# Altium project RespiraWorks Ventilator.PrjPcb (part 1 of 4)
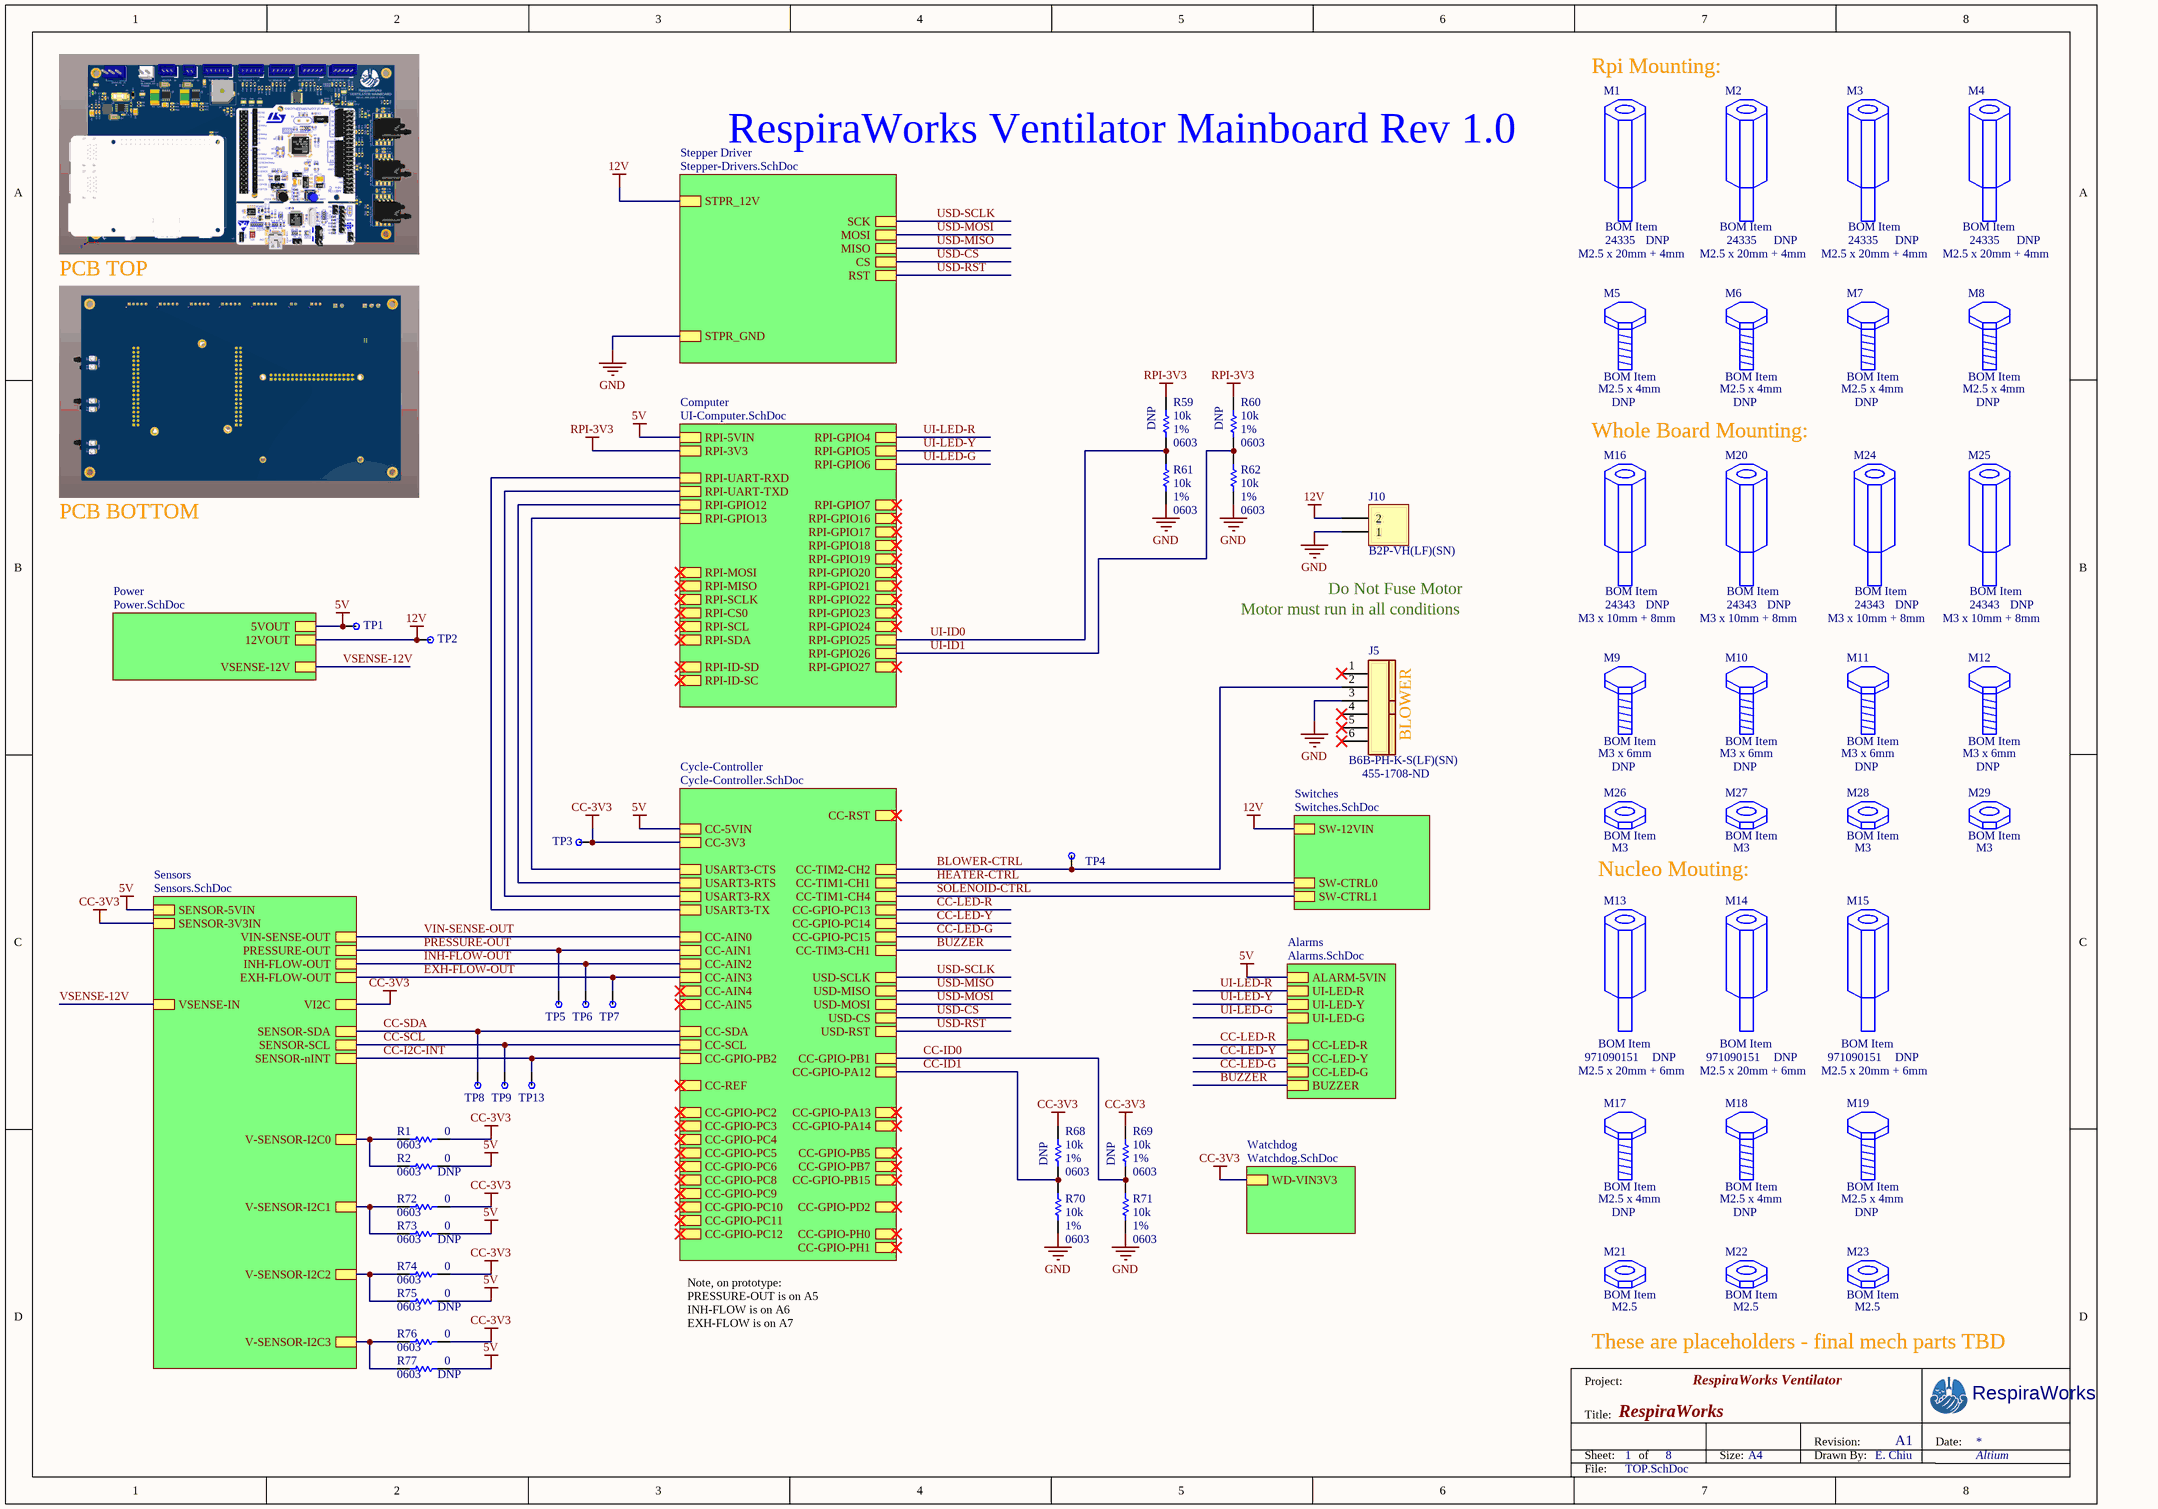
[diagram p0: TOP.SchDoc]
12 sheets, 255 parts. Net scope: hierarchical (ports join the sheet entries above them; power ports are global).
Board file: RespiraWorks Ventilator Rev 1.PcbDoc
Sheets:
  TOP.SchDoc
    Cycle-Controller = Cycle-Controller.SchDoc
    Computer = UI-Computer.SchDoc
    Sensors = Sensors.SchDoc
    Switches = Switches.SchDoc
    Watchdog = Watchdog.SchDoc
    Alarms = Alarms.SchDoc
    Power = Power.SchDoc
    Stepper Driver = Stepper-Drivers.SchDoc
      driver-1 = Stepper-Driver-1.SchDoc
      driver-2 = Stepper-Driver-2.SchDoc
      driver-3 = Stepper-Driver-3.SchDoc

## Sheet TOP.SchDoc: RespiraWorks
size A3; CompanyName: RespiraWorks; DrawnBy: E. Chiu; Organization: Altium; DocumentNumber: 1; Revision: A1; SheetNumber: 1; SheetTotal: 8; PageSetup: Record=PageOptions|CenterHorizontal=True|CenterVertical=True|PrintScale=0.67|XCorrection=1.00|YCorrection=1.00|PrintKind=0|BorderSize=5000000|LeftOffset=0|BottomOffset=0|Orientation=2|PaperLength=1000|PaperWidth=1000|Scale=100|PaperSource=276|PrintQuality=-3|MediaType=1|DitherType=10|PrintScaleMode=1|PaperKind=11"x17" 279.4x431.8mm|PaperIndex=3; ProjectName: FALCON 3S

### Parts
J5  B6B-PH-K-S(LF)(SN)  Supplier Part Number 1: 455-1708-ND  [JST_B6B-XH-AM]
J10  B2P-VH(LF)(SN)  [B2P-VH(LF)(SN)]
M1  BOM Item  value M2.5 x 20mm + 4mm  Manufacturer P/N: 24335  Do Not Populate: DNP  (mechanical)
M2  BOM Item  value M2.5 x 20mm + 4mm  Manufacturer P/N: 24335  Do Not Populate: DNP  (mechanical)
M3  BOM Item  value M2.5 x 20mm + 4mm  Manufacturer P/N: 24335  Do Not Populate: DNP  (mechanical)
M4  BOM Item  value M2.5 x 20mm + 4mm  Manufacturer P/N: 24335  Do Not Populate: DNP  (mechanical)
M5  BOM Item  value M2.5 x 4mm  Do Not Populate: DNP  (mechanical)
M6  BOM Item  value M2.5 x 4mm  Do Not Populate: DNP  (mechanical)
M7  BOM Item  value M2.5 x 4mm  Do Not Populate: DNP  (mechanical)
M8  BOM Item  value M2.5 x 4mm  Do Not Populate: DNP  (mechanical)
M9  BOM Item  value M3 x 6mm  Do Not Populate: DNP  (mechanical)
M10  BOM Item  value M3 x 6mm  Do Not Populate: DNP  (mechanical)
M11  BOM Item  value M3 x 6mm  Do Not Populate: DNP  (mechanical)
M12  BOM Item  value M3 x 6mm  Do Not Populate: DNP  (mechanical)
M13  BOM Item  value M2.5 x 20mm + 6mm  Manufacturer P/N: 971090151  Do Not Populate: DNP  (mechanical)
M14  BOM Item  value M2.5 x 20mm + 6mm  Manufacturer P/N: 971090151  Do Not Populate: DNP  (mechanical)
M15  BOM Item  value M2.5 x 20mm + 6mm  Manufacturer P/N: 971090151  Do Not Populate: DNP  (mechanical)
M16  BOM Item  value M3 x 10mm + 8mm  Manufacturer P/N: 24343  Do Not Populate: DNP  (mechanical)
M17  BOM Item  value M2.5 x 4mm  Do Not Populate: DNP  (mechanical)
M18  BOM Item  value M2.5 x 4mm  Do Not Populate: DNP  (mechanical)
M19  BOM Item  value M2.5 x 4mm  Do Not Populate: DNP  (mechanical)
M20  BOM Item  value M3 x 10mm + 8mm  Manufacturer P/N: 24343  Do Not Populate: DNP  (mechanical)
M21  BOM Item  value M2.5  (mechanical)
M22  BOM Item  value M2.5  (mechanical)
M23  BOM Item  value M2.5  (mechanical)
M24  BOM Item  value M3 x 10mm + 8mm  Manufacturer P/N: 24343  Do Not Populate: DNP  (mechanical)
M25  BOM Item  value M3 x 10mm + 8mm  Manufacturer P/N: 24343  Do Not Populate: DNP  (mechanical)
M26  BOM Item  value M3  (mechanical)
M27  BOM Item  value M3  (mechanical)
M28  BOM Item  value M3  (mechanical)
M29  BOM Item  value M3  (mechanical)
R1  value 0  PCB Package: 0603  [RES0603]  (hidden comment: RES 0603)
R2  value 0  PCB Package: 0603  Do Not Populate: DNP  [RES0603]  (hidden comment: RES 0603)
R59  value 10k  PCB Package: 0603  Tolerance: 1%  Do Not Populate: DNP  [RES0603]  (hidden comment: RES 0603)
R60  value 10k  PCB Package: 0603  Tolerance: 1%  Do Not Populate: DNP  [RES0603]  (hidden comment: RES 0603)
R61  value 10k  PCB Package: 0603  Tolerance: 1%  [RES0603]  (hidden comment: RES 0603)
R62  value 10k  PCB Package: 0603  Tolerance: 1%  [RES0603]  (hidden comment: RES 0603)
R68  value 10k  PCB Package: 0603  Tolerance: 1%  Do Not Populate: DNP  [RES0603]  (hidden comment: RES 0603)
R69  value 10k  PCB Package: 0603  Tolerance: 1%  Do Not Populate: DNP  [RES0603]  (hidden comment: RES 0603)
R70  value 10k  PCB Package: 0603  Tolerance: 1%  [RES0603]  (hidden comment: RES 0603)
R71  value 10k  PCB Package: 0603  Tolerance: 1%  [RES0603]  (hidden comment: RES 0603)
R72  value 0  PCB Package: 0603  [RES0603]  (hidden comment: RES 0603)
R73  value 0  PCB Package: 0603  Do Not Populate: DNP  [RES0603]  (hidden comment: RES 0603)
R74  value 0  PCB Package: 0603  [RES0603]  (hidden comment: RES 0603)
R75  value 0  PCB Package: 0603  Do Not Populate: DNP  [RES0603]  (hidden comment: RES 0603)
R76  value 0  PCB Package: 0603  [RES0603]  (hidden comment: RES 0603)
R77  value 0  PCB Package: 0603  Do Not Populate: DNP  [RES0603]  (hidden comment: RES 0603)
TP1  TP-SMT  [TP-5015]  (value not drawn)
TP2  TP-SMT  [TP-5015]  (value not drawn)
TP3  TP-SMT  [TP-5015]  (value not drawn)
TP4  TP-SMT  [TP-5015]  (value not drawn)
TP5  TP-SMT  [TP-5015]  (value not drawn)
TP6  TP-SMT  [TP-5015]  (value not drawn)
TP7  TP-SMT  [TP-5015]  (value not drawn)
TP8  TP-SMT  [TP-5015]  (value not drawn)
TP9  TP-SMT  [TP-5015]  (value not drawn)
TP13  TP-SMT  [TP-5015]  (value not drawn)

### Sub-sheets
Alarms = Alarms.SchDoc: BUZZER, CC-LED-R, UI-LED-Y, CC-LED-G, UI-LED-G, UI-LED-R, CC-LED-Y, ALARM-5VIN
Computer = UI-Computer.SchDoc: RPI-SDA, RPI-SCL, RPI-GPIO6, RPI-GPIO7, RPI-ID-SC, RPI-GPIO12, RPI-GPIO24, RPI-GPIO25, RPI-GPIO4, RPI-GPIO18, RPI-UART-TXD, RPI-GPIO16, RPI-SCLK, RPI-GPIO27, RPI-MOSI, RPI-3V3, RPI-MISO, RPI-GPIO17, RPI-GPIO20, RPI-GPIO23, RPI-GPIO19, RPI-ID-SD, RPI-GPIO22, RPI-GPIO26, RPI-CS0, RPI-UART-RXD, RPI-GPIO13, RPI-GPIO21, RPI-GPIO5, RPI-5VIN
Cycle-Controller = Cycle-Controller.SchDoc: CC-3V3, CC-AIN5, CC-AIN1, CC-TIM2-CH2, CC-AIN2, CC-GPIO-PA12, CC-TIM1-CH1, CC-TIM3-CH1, CC-GPIO-PB1, CC-RST, CC-AIN3, CC-GPIO-PB5, CC-AIN4, CC-AIN0, CC-REF, CC-5VIN, CC-SCL, CC-SDA, USART3-RX, USART3-CTS, USART3-TX, USART3-RTS, CC-GPIO-PC14, CC-GPIO-PC13, CC-GPIO-PC15, CC-GPIO-PB2, CC-TIM1-CH4, CC-GPIO-PC11, CC-GPIO-PC10, CC-GPIO-PC4, CC-GPIO-PB15, CC-GPIO-PC2, CC-GPIO-PC8, CC-GPIO-PC5, CC-GPIO-PH0, CC-GPIO-PC9, CC-GPIO-PC6, CC-GPIO-PH1, CC-GPIO-PC12, CC-GPIO-PD2, CC-GPIO-PC3, CC-GPIO-PA14, CC-GPIO-PA13, CC-GPIO-PB7, USD-SCLK, USD-MISO, USD-MOSI, USD-CS, USD-RST
Power = Power.SchDoc: 5VOUT, VSENSE-12V, 12VOUT
Sensors = Sensors.SchDoc: INH-FLOW-OUT, SENSOR-5VIN, PRESSURE-OUT, EXH-FLOW-OUT, VIN-SENSE-OUT, VSENSE-IN, SENSOR-SDA, V-SENSOR-I2C0, VI2C, SENSOR-nINT, SENSOR-SCL, SENSOR-3V3IN, V-SENSOR-I2C1, V-SENSOR-I2C3, V-SENSOR-I2C2
Stepper Driver = Stepper-Drivers.SchDoc: SCK, CS, MOSI, STPR_GND, STPR_12V, RST, MISO
Switches = Switches.SchDoc: SW-CTRL1, SW-12VIN, SW-CTRL0
Watchdog = Watchdog.SchDoc: WD-VIN3V3

### Nets
5V: R2.2 R73.2 R75.2 R77.2 TP1.1 ; sheet Cycle-Controller/CC-5VIN, sheet Computer/RPI-5VIN, sheet Sensors/SENSOR-5VIN, sheet Alarms/ALARM-5VIN, sheet Power/5VOUT
12V: J10.2 TP2.1 ; sheet Sensors/VSENSE-IN, sheet Switches/SW-12VIN, sheet Power/VSENSE-12V, sheet Power/12VOUT, sheet Stepper Driver/STPR_12V  [also labelled VSENSE-12V]
CC-3V3: R1.2 R68.2 R69.2 R72.2 R74.2 R76.2 TP3.1 ; sheet Cycle-Controller/CC-3V3, sheet Cycle-Controller/CC-REF, sheet Sensors/VI2C, sheet Sensors/SENSOR-3V3IN, sheet Watchdog/WD-VIN3V3
GND: J5.3 J10.1 R61.1 R62.1 R70.1 R71.1 ; sheet Stepper Driver/STPR_GND
RPI-3V3: R59.2 R60.2 ; sheet Computer/RPI-3V3
BLOWER-CTRL: J5.2 TP4.1 ; sheet Cycle-Controller/CC-TIM2-CH2
BUZZER: sheet Cycle-Controller/CC-TIM3-CH1, sheet Alarms/BUZZER
CC-I2C-INT: TP13.1 ; sheet Cycle-Controller/CC-GPIO-PB2, sheet Sensors/SENSOR-nINT
CC-ID0: R69.1 R71.2 ; sheet Cycle-Controller/CC-GPIO-PB1
CC-ID1: R68.1 R70.2 ; sheet Cycle-Controller/CC-GPIO-PA12
CC-LED-G: sheet Cycle-Controller/CC-GPIO-PC15, sheet Alarms/CC-LED-G
CC-LED-R: sheet Cycle-Controller/CC-GPIO-PC13, sheet Alarms/CC-LED-R
CC-LED-Y: sheet Cycle-Controller/CC-GPIO-PC14, sheet Alarms/CC-LED-Y
CC-SCL: TP9.1 ; sheet Cycle-Controller/CC-SCL, sheet Sensors/SENSOR-SCL
CC-SDA: TP8.1 ; sheet Cycle-Controller/CC-SDA, sheet Sensors/SENSOR-SDA
EXH-FLOW-OUT: TP7.1 ; sheet Cycle-Controller/CC-AIN3, sheet Sensors/EXH-FLOW-OUT
HEATER-CTRL: sheet Cycle-Controller/CC-TIM1-CH1, sheet Switches/SW-CTRL0
INH-FLOW-OUT: TP6.1 ; sheet Cycle-Controller/CC-AIN2, sheet Sensors/INH-FLOW-OUT
PB10: sheet Cycle-Controller/USART3-TX, sheet Computer/RPI-UART-RXD
PB11: sheet Cycle-Controller/USART3-RX, sheet Computer/RPI-UART-TXD
PB13: sheet Cycle-Controller/USART3-RTS, sheet Computer/RPI-GPIO12
PB14: sheet Cycle-Controller/USART3-CTS, sheet Computer/RPI-GPIO13
PRESSURE-OUT: TP5.1 ; sheet Cycle-Controller/CC-AIN1, sheet Sensors/PRESSURE-OUT
SOLENOID-CTRL: sheet Cycle-Controller/CC-TIM1-CH4, sheet Switches/SW-CTRL1
UI-ID0: R59.1 R61.2 ; sheet Computer/RPI-GPIO25
UI-ID1: R60.1 R62.2 ; sheet Computer/RPI-GPIO26
UI-LED-G: sheet Computer/RPI-GPIO6, sheet Alarms/UI-LED-G
UI-LED-R: sheet Computer/RPI-GPIO4, sheet Alarms/UI-LED-R
UI-LED-Y: sheet Computer/RPI-GPIO5, sheet Alarms/UI-LED-Y
USD-CS: sheet Cycle-Controller/USD-CS, sheet Stepper Driver/CS
USD-MISO: sheet Cycle-Controller/USD-MISO, sheet Stepper Driver/MISO
USD-MOSI: sheet Cycle-Controller/USD-MOSI, sheet Stepper Driver/MOSI
USD-RST: sheet Cycle-Controller/USD-RST, sheet Stepper Driver/RST
USD-SCLK: sheet Cycle-Controller/USD-SCLK, sheet Stepper Driver/SCK
V-SENSOR-I2C0: R1.1 R2.1 ; sheet Sensors/V-SENSOR-I2C0
V-SENSOR-I2C1: R72.1 R73.1 ; sheet Sensors/V-SENSOR-I2C1
V-SENSOR-I2C2: R74.1 R75.1 ; sheet Sensors/V-SENSOR-I2C2
V-SENSOR-I2C3: R76.1 R77.1 ; sheet Sensors/V-SENSOR-I2C3
VIN-SENSE-OUT: sheet Cycle-Controller/CC-AIN0, sheet Sensors/VIN-SENSE-OUT

Not connected (* = marked no-connect by the designer): J5 1* 4* 5* 6*

### Notes on the sheet
- Rpi Mounting:
- (near M1) RespiraWorks Ventilator Mainboard Rev 1.0
- PCB TOP
- Whole Board Mounting:
- PCB BOTTOM
- Motor must run in all conditions
- Do Not Fuse Motor
- (near J5) BLOWER
- Nucleo Mouting:
- Note, on prototype:
  PRESSURE-OUT is on A5
  INH-FLOW is on A6
  EXH-FLOW is on A7
- Project:
- These are placeholders - final mech parts TBD
- RespiraWorks Ventilator
- Title:
- Sheet:
- of
- Size:
- A4
- Drawn By:
- Revision:
- Date:
- File:

### Library data of the parts
J5 = B6B-PH-K-S(LF)(SN): CONN HEADER PH TOP 6POS 2MM; Manufacturer: JST Sales America Inc.; Connector Type: Header, Shrouded; Number of Positions: 6; Number of Positions Loaded: All; Pitch: 0.079" (2.00mm); Supplier 1: Digi-Key; Manufacturer Part Number: B6B-PH-K-S(LF)(SN); RoHS: RoHS Compliant; Category: Connectors, Interconnects; Stock 1: 30111; Pricing 1: 1=0.33, 10=0.313, 100=0.2194, 500=0.18808, 1000=0.15674, 5000=0.13435, 10000=0.12539 (USD); Packaging: Bulk; Part Status: Active; Contact Type: Male Pin; Number of Rows: 1; Row Spacing: -; Contact Mating Length: 0.130" (3.30mm); Mounting Type: Through Hole; Termination: Press-Fit, Solder; Fastening Type: Detent Lock; Features: -; Contact Finish: Tin; Contact Finish Thickness: -; Color: Natural; ComponentLink1URL: http://www.jst-mfg.com/product/pdf/eng/ePH.pdf; ComponentLink1Description: http://www.jst-mfg.com/product/pdf/eng/ePH.pdf; Manufacturer P/N: B6B-PH-K-S(LF)(SN)
J10 = B2P-VH(LF)(SN): JST-VH HEADER VERT 2POS 3.96MM; Manufacturer: JST; Do Not Populate: *; Manufacturer P/N: B2P-VH(LF)(SN)
M1-M4 M16 M20 M24 M25 = STANDOFF: [BOM Item] Generic Standoff; Manufacturer: Keystone
M5-M8 M17-M19 = SCREW: [BOM Item] Generic Nut; Manufacturer: Keystone; Manufacturer P/N: 29300
M9-M12 = SCREW: [BOM Item] Generic Nut; Manufacturer: Keystone; Manufacturer P/N: 29311
M13-M15 = STANDOFF: [BOM Item] Generic Standoff; Manufacturer: Wurth
M21-M23 = NUT: [BOM Item] Generic Nut; Manufacturer: Keystone; Manufacturer P/N: 4707; Do Not Populate: DNP
M26-M29 = NUT: [BOM Item] Generic Nut; Manufacturer: B&F; Manufacturer P/N: MHNZ 003; Do Not Populate: DNP
R1 R2 R72-R77 = RES 0603: Manufacturer P/N: RC0603JR-070RL; Manufacturer: Yageo; Tolerance: 5%
  R1 R72 R74 R76: Do Not Populate: *
R59-R62 R68-R71 = RES 0603: Manufacturer P/N: ERJ-3EKF1002V; Manufacturer: Panasonic
  R61 R62 R70 R71: Do Not Populate: *
TP1-TP9 TP13 = TP-SMT: Keystone 5015 SMT Mini Testpoint; Manufacturer P/N: 5015; Manufacturer: Keystone; PCB Package: TP-5015; Tolerance: 5015; Do Not Populate: *; Value: *

## Sheet Cycle-Controller.SchDoc: RespiraWorks
size A3; CompanyName: RespiraWorks; DrawnBy: E. Chiu; Organization: Altium; DocumentNumber: 4; Revision: A1; SheetNumber: 4; SheetTotal: 8; PageSetup: Record=PageOptions|CenterHorizontal=True|CenterVertical=True|PrintScale=0.67|XCorrection=1.00|YCorrection=1.00|PrintKind=0|BorderSize=5000000|LeftOffset=0|BottomOffset=0|Orientation=2|PaperLength=1000|PaperWidth=1000|Scale=100|PaperSource=276|PrintQuality=-3|MediaType=1|DitherType=10|PrintScaleMode=1|PaperKind=11"x17" 279.4x431.8mm|PaperIndex=3; ProjectName: FALCON 3S
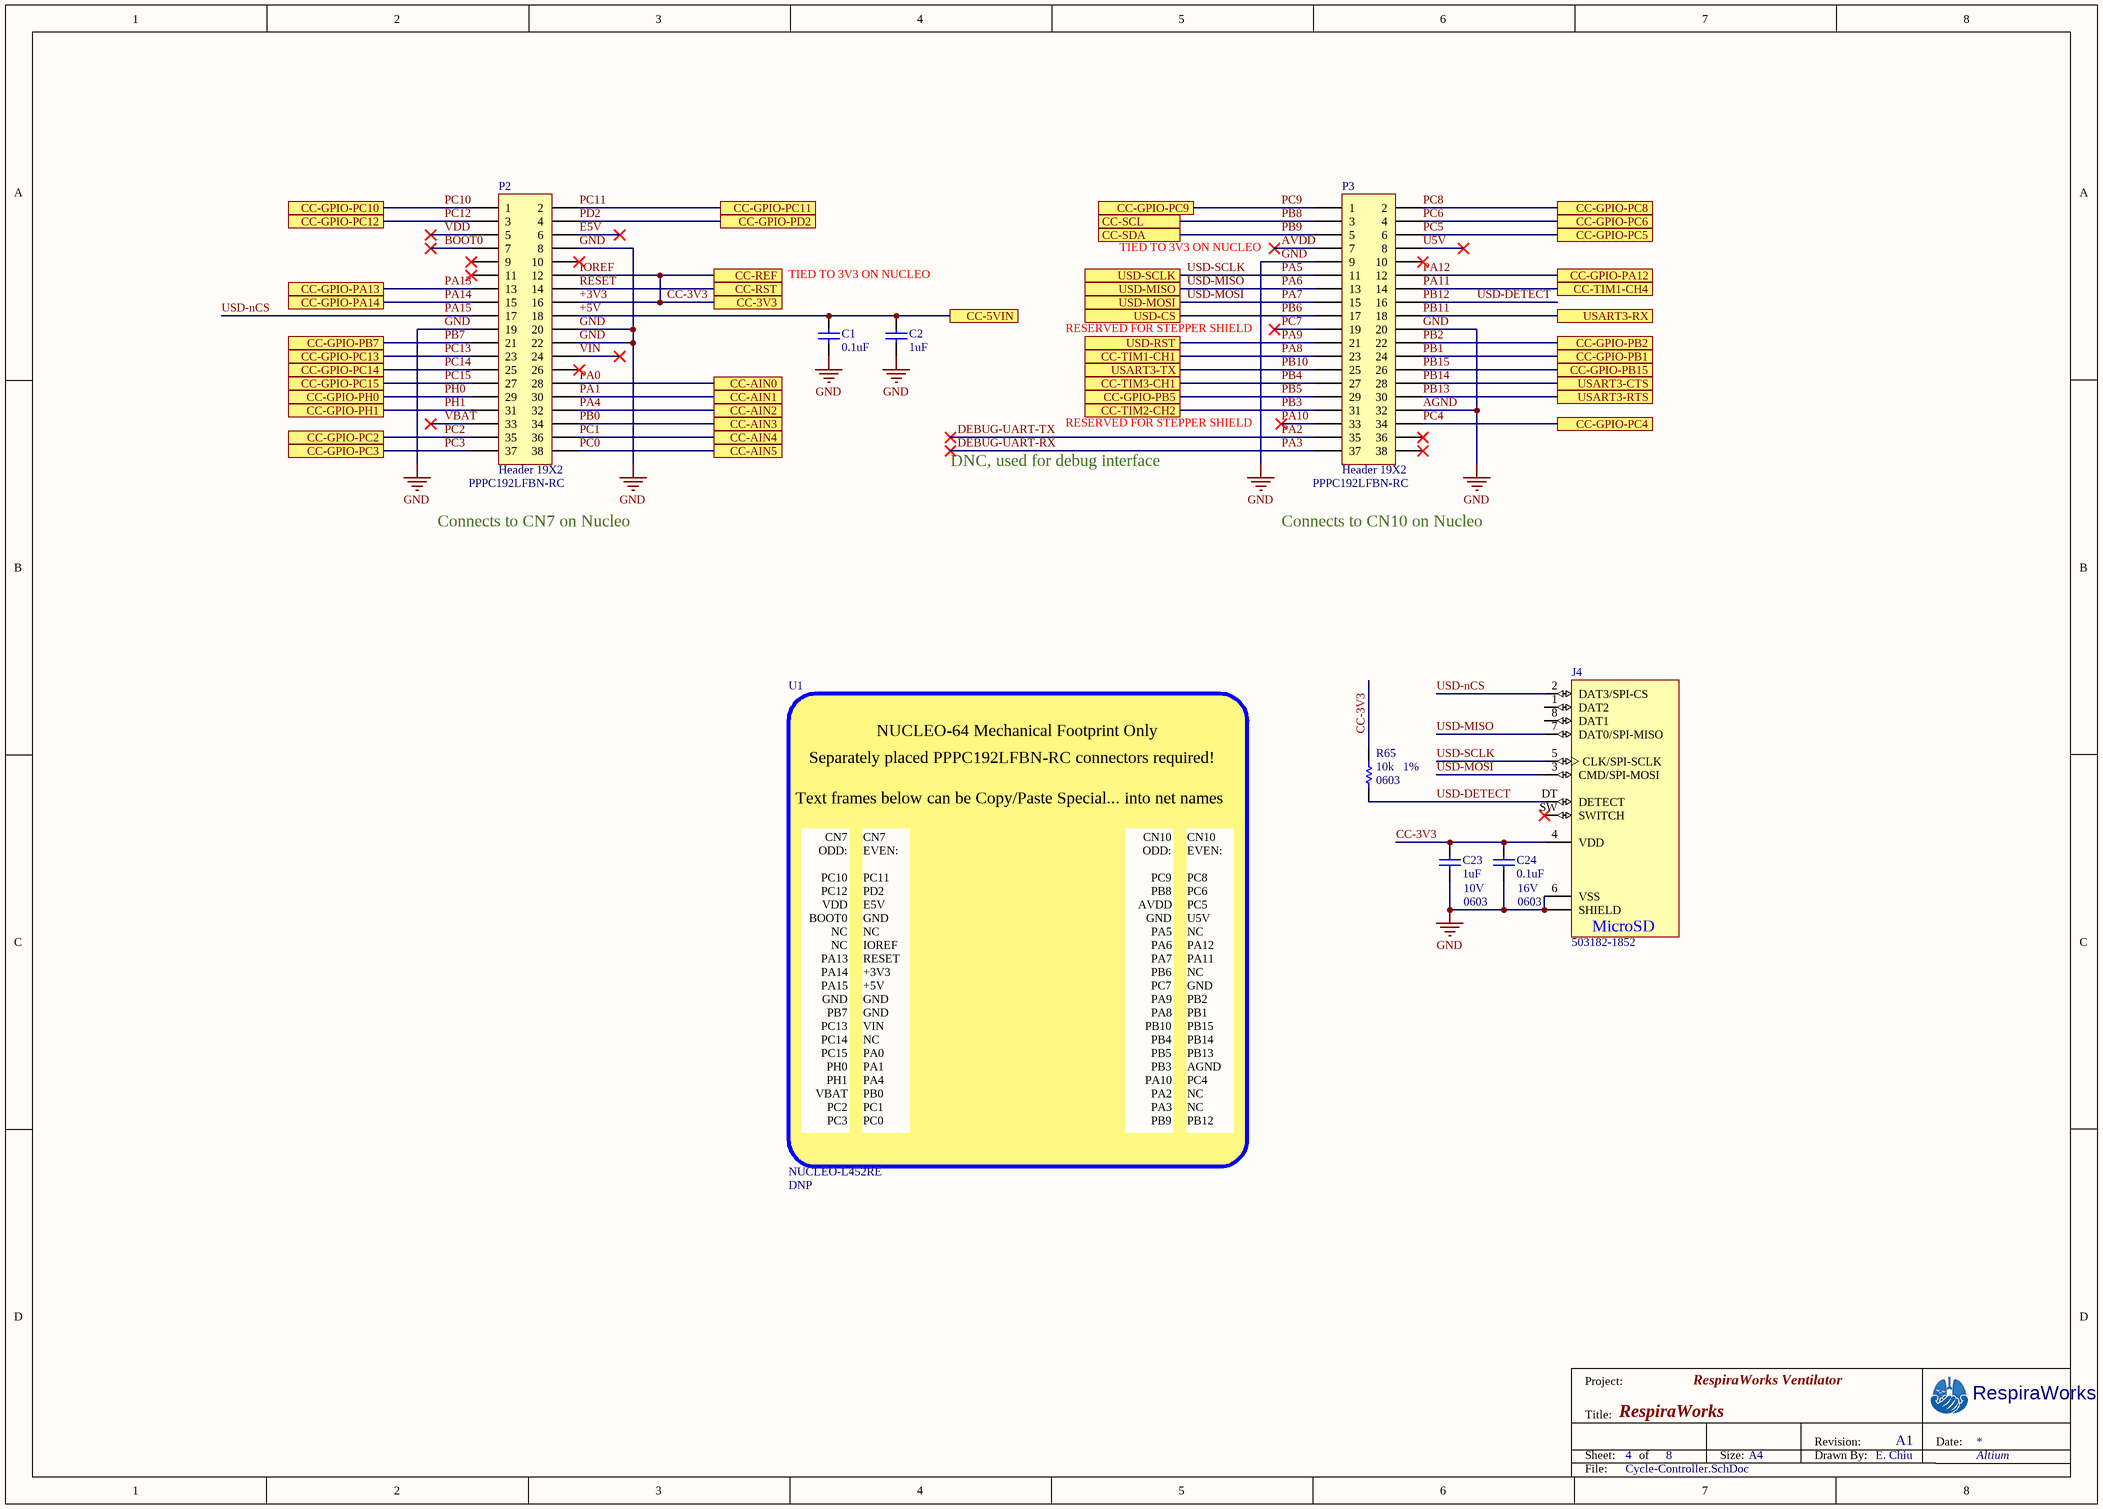
[diagram p1: Cycle-Controller.SchDoc]

### Parts
C1  value 0.1uF  [CAP0603]  (hidden comment: CAP 0603)
C2  value 1uF  [CAP0603]  (hidden comment: CAP 0603)
C23  value 1uF  Voltage: 10V  PCB Package: 0603  [CAP0603]  (hidden comment: CAP 0603)
C24  value 0.1uF  Voltage: 16V  PCB Package: 0603  [CAP0603]  (hidden comment: CAP 0603)
J4  503182-1852  [503182-1852]
P2  Header 19X2  [PPPC192LFBN-RC]
P3  Header 19X2  [PPPC192LFBN-RC]
R65  value 10k  PCB Package: 0603  Tolerance: 1%  [RES0603]  (hidden comment: RES 0603)
U1  NUCLEO-L452RE  Do Not Populate: DNP  [NUCLEO-64]

### Ports
CC-3V3, CC-5VIN, CC-AIN0, CC-AIN1, CC-AIN2, CC-AIN3, CC-AIN4, CC-AIN5, CC-GPIO-PA12, CC-GPIO-PA13, CC-GPIO-PA14, CC-GPIO-PB1, CC-GPIO-PB2, CC-GPIO-PB5, CC-GPIO-PB7, CC-GPIO-PB15, CC-GPIO-PC2, CC-GPIO-PC3, CC-GPIO-PC4, CC-GPIO-PC5, CC-GPIO-PC6, CC-GPIO-PC8, CC-GPIO-PC9, CC-GPIO-PC10, CC-GPIO-PC11, CC-GPIO-PC12, CC-GPIO-PC13, CC-GPIO-PC14, CC-GPIO-PC15, CC-GPIO-PD2, CC-GPIO-PH0, CC-GPIO-PH1, CC-REF, CC-RST, CC-SCL, CC-SDA, CC-TIM1-CH1, CC-TIM1-CH4, CC-TIM2-CH2, CC-TIM3-CH1, USART3-CTS, USART3-RTS, USART3-RX, USART3-TX, USD-CS, USD-MISO, USD-MOSI, USD-RST, USD-SCLK

### Nets
+5V: C1.1 C2.1 P2.18 ; port CC-5VIN  [project net 5V]
CC-3V3: C23.1 C24.1 J4.4(VDD) P2.12 P2.16 R65.2 ; port CC-REF, port CC-3V3  [also labelled +3V3, IOREF]
GND: C1.2 C2.2 C23.2 C24.2 J4.6(VSS) J4.P1(SHIELD) J4.P2(SHIELD) J4.P3(SHIELD) J4.P4(SHIELD) J4.P5(SHIELD) P2.8 P2.19 P2.20 P2.22 P3.9 P3.20 P3.32  [also labelled AGND]
AVDD: P3.7
BOOT0: P2.7
DEBUG-UART-RX: P3.37  [also labelled PA3]
DEBUG-UART-TX: P3.35  [also labelled PA2]
E5V: P2.6
PA0: P2.28 ; port CC-AIN0  [project net VIN-SENSE-OUT]
PA1: P2.30 ; port CC-AIN1  [project net PRESSURE-OUT]
PA4: P2.32 ; port CC-AIN2  [project net INH-FLOW-OUT]
PA8: P3.23 ; port CC-TIM1-CH1  [project net HEATER-CTRL]
PA9: P3.21 ; port USD-RST  [project net USD-RST]
PA10: P3.33
PA11: P3.14 ; port CC-TIM1-CH4  [project net SOLENOID-CTRL]
PA12: P3.12 ; port CC-GPIO-PA12  [project net CC-ID1]
PA13: P2.13 ; port CC-GPIO-PA13
PA14: P2.15 ; port CC-GPIO-PA14
PA15: J4.2(DAT3/SPI-CS) P2.17  [also labelled USD-nCS]
PB0: P2.34 ; port CC-AIN3  [project net EXH-FLOW-OUT]
PB1: P3.24 ; port CC-GPIO-PB1  [project net CC-ID0]
PB2: P3.22 ; port CC-GPIO-PB2  [project net CC-I2C-INT]
PB3: P3.31 ; port CC-TIM2-CH2  [project net BLOWER-CTRL]
PB4: P3.27 ; port CC-TIM3-CH1  [project net BUZZER]
PB5: P3.29 ; port CC-GPIO-PB5
PB6: P3.17 ; port USD-CS  [project net USD-CS]
PB7: P2.21 ; port CC-GPIO-PB7
PB8: P3.3 ; port CC-SCL  [project net CC-SCL]
PB9: P3.5 ; port CC-SDA  [project net CC-SDA]
PB10: P3.25 ; port USART3-TX
PB11: P3.18 ; port USART3-RX
PB12: J4.DT(DETECT) P3.16 R65.1  [also labelled USD-DETECT]
PB13: P3.30 ; port USART3-RTS
PB14: P3.28 ; port USART3-CTS
PB15: P3.26 ; port CC-GPIO-PB15
PC0: P2.38 ; port CC-AIN5
PC1: P2.36 ; port CC-AIN4
PC2: P2.35 ; port CC-GPIO-PC2
PC3: P2.37 ; port CC-GPIO-PC3
PC4: P3.34 ; port CC-GPIO-PC4
PC5: P3.6 ; port CC-GPIO-PC5
PC6: P3.4 ; port CC-GPIO-PC6
PC7: P3.19
PC8: P3.2 ; port CC-GPIO-PC8
PC9: P3.1 ; port CC-GPIO-PC9
PC10: P2.1 ; port CC-GPIO-PC10
PC11: P2.2 ; port CC-GPIO-PC11
PC12: P2.3 ; port CC-GPIO-PC12
PC13: P2.23 ; port CC-GPIO-PC13  [project net CC-LED-R]
PC14: P2.25 ; port CC-GPIO-PC14  [project net CC-LED-Y]
PC15: P2.27 ; port CC-GPIO-PC15  [project net CC-LED-G]
PD2: P2.4 ; port CC-GPIO-PD2
PH0: P2.29 ; port CC-GPIO-PH0
PH1: P2.31 ; port CC-GPIO-PH1
RESET: P2.14 ; port CC-RST
U5V: P3.8
USD-MISO: J4.7(DAT0/SPI-MISO) P3.13 ; port USD-MISO  [also labelled PA6]
USD-MOSI: J4.3(CMD/SPI-MOSI) P3.15 ; port USD-MOSI  [also labelled PA7]
USD-SCLK: J4.5(CLK/SPI-SCLK) P3.11 ; port USD-SCLK  [also labelled PA5]
VBAT: P2.33
VDD: P2.5
VIN: P2.24

Not connected (* = marked no-connect by the designer): J4 1(DAT2) 8(DAT1) SW(SWITCH)*; P2 9* 10* 11* 26*; P3 10* 36* 38*

### Notes on the sheet
- TIED TO 3V3 ON NUCLEO
- RESERVED FOR STEPPER SHIELD
- DNC, used for debug interface
- Connects to CN7 on Nucleo
- Connects to CN10 on Nucleo
- Project:
- RespiraWorks Ventilator
- Title:
- Sheet:
- of
- Size:
- A4
- Drawn By:
- Revision:
- Date:
- File:
- (in symbol 503182-1852) MicroSD
- (in symbol NUCLEO-L452RE) NUCLEO-64 Mechanical Footprint Only; Separately placed PPPC192LFBN-RC connectors required!; Text frames below can be Copy/Paste Special... into net names; CN7 / ODD: / PC10 / PC12 / VDD / BOOT0 / NC / NC / PA13 / PA14 / PA15 / GND / PB7 / PC13 / PC14 / PC15 / PH0 / PH1 / VBAT / PC2 / PC3 /; CN7 / EVEN: / PC11 / PD2 / E5V / GND / NC / IOREF / RESET / +3V3 / +5V / GND / GND / VIN / NC / PA0 / PA1 / PA4 / PB0 / PC1 / PC0 /; CN10 / ODD: / PC9 / PB8 / AVDD / GND / PA5 / PA6 / PA7 / PB6 / PC7 / PA9 / PA8 / PB10 / PB4 / PB5 / PB3 / PA10 / PA2 / PA3 / PB9 /; CN10 / EVEN: / PC8 / PC6 / PC5 / U5V / NC / PA12 / PA11 / NC / GND / PB2 / PB1 / PB15 / PB14 / PB13 / AGND / PC4 / NC / NC / PB12

### Library data of the parts
C1 = CAP 0603: Manufacturer P/N: CC0603KRX7R7BB104; Manufacturer: Yageo; Voltage: 16V; PCB Package: 0603; Type: X7R; Do Not Populate: *
C2 = CAP 0603: Manufacturer P/N: CC0603KRX7R6BB105; Manufacturer: Yageo; Voltage: 10V; PCB Package: 0603; Type: X7R; Do Not Populate: *
C23 = CAP 0603: Manufacturer P/N: CC0603KRX7R6BB105; Manufacturer: Yageo; Type: X7R; Do Not Populate: *
C24 = CAP 0603: Manufacturer P/N: CC0603KRX7R7BB104; Manufacturer: Yageo; Type: X7R; Do Not Populate: *
J4 = 503182-1852: 10 _8 + 2_ Position Card Connector microSD Surface Mount, Right Angle Gold; Manufacturer: Molex; Manufacturer P/N: 5031821852; Digi-Key_Part_Number: WM12834CT-ND; Digi-Key_Purchase_URL: https://www.digikey.com.tr/product-detail/en/molex/5031821852/WM12834CT-ND/5823232?utm_source=snapeda&utm_medium=aggregator&utm_campaign=symbol; SnapEDA_Link: https://www.snapeda.com/parts/5031821852/Molex/view-part/46835/?ref=snap; Value: *; Package: None
P2 P3 = PPPC192LFBN-RC: Female Header, 0.100" Pitch, 19x2; Manufacturer: Sullins; Do Not Populate: *; Manufacturer P/N: PPPC192LFBN-RC; Value: *
R65 = RES 0603: as R59 on sheet TOP; Do Not Populate: *
U1 = NUCLEO-L452RE: STM32F446RE Nucleo MCU Board; Manufacturer: ST; Manufacturer P/N: NUCLEO-L452RE

## Sheet UI-Computer.SchDoc: RespiraWorks
size A3; CompanyName: RespiraWorks; DrawnBy: E. Chiu; Organization: Altium; DocumentNumber: 3; Revision: A1; SheetNumber: 3; SheetTotal: 8; PageSetup: Record=PageOptions|CenterHorizontal=True|CenterVertical=True|PrintScale=0.67|XCorrection=1.00|YCorrection=1.00|PrintKind=0|BorderSize=5000000|LeftOffset=0|BottomOffset=0|Orientation=2|PaperLength=1000|PaperWidth=1000|Scale=100|PaperSource=276|PrintQuality=-3|MediaType=1|DitherType=10|PrintScaleMode=1|PaperKind=11"x17" 279.4x431.8mm|PaperIndex=3; ProjectName: FALCON 3S
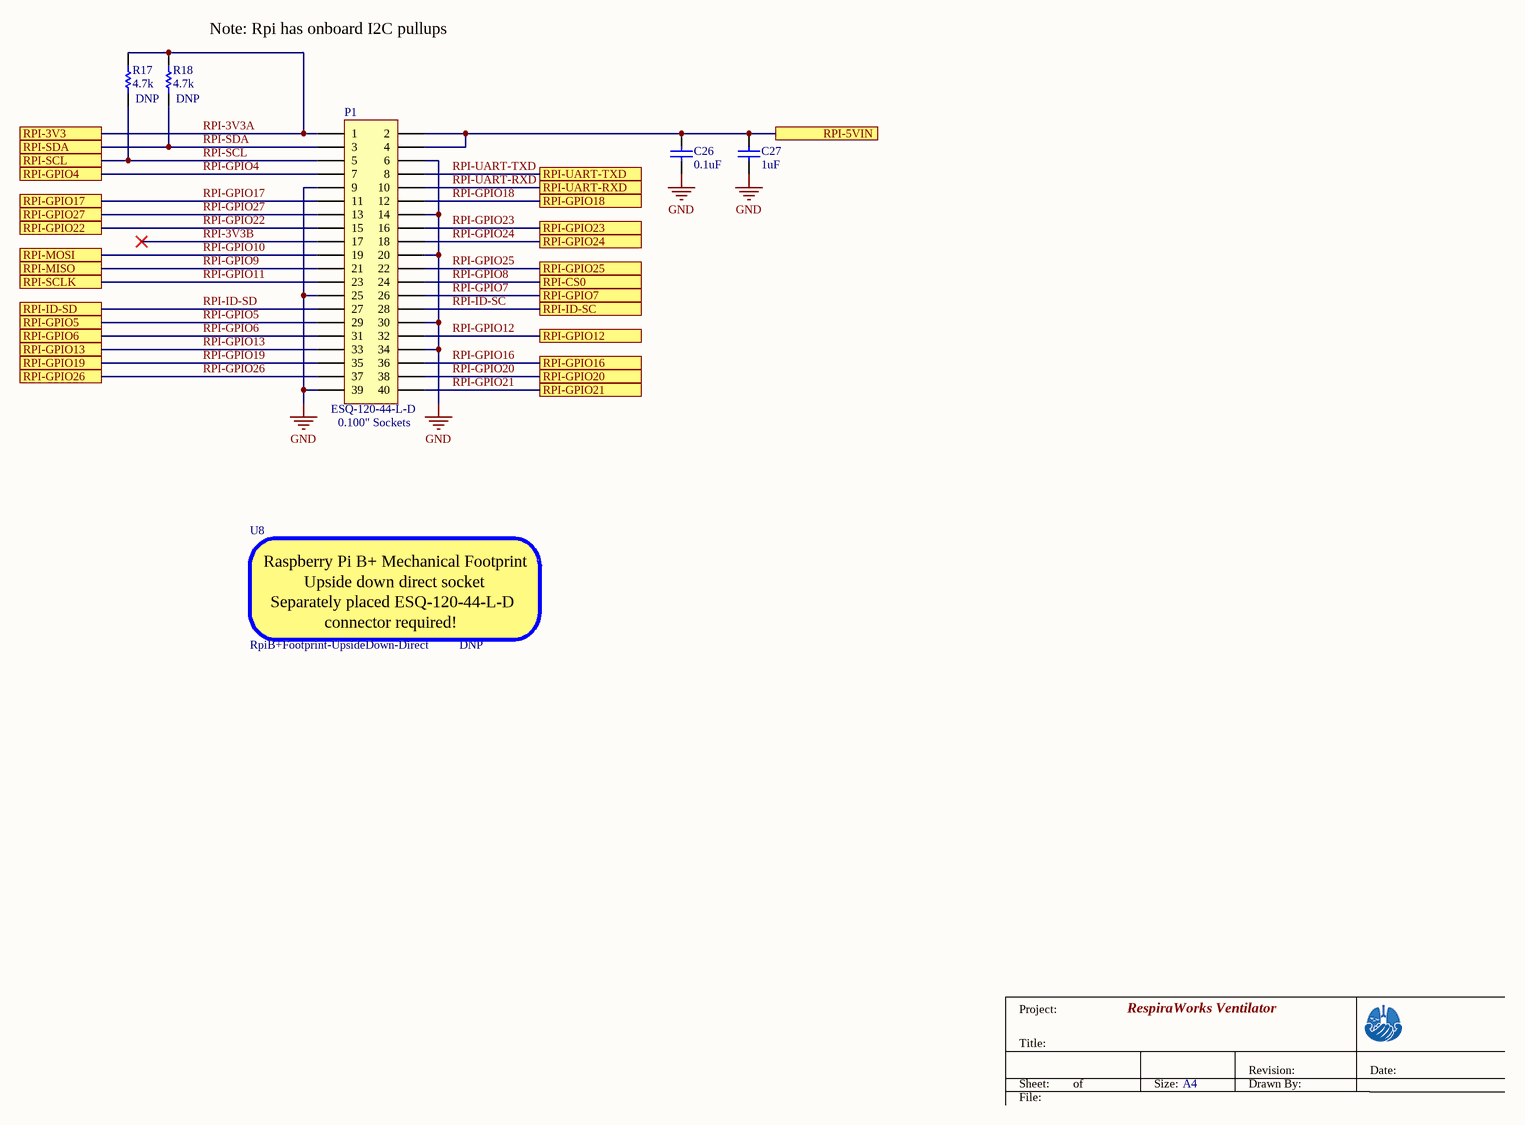
[diagram p2: UI-Computer.SchDoc]

### Parts
C26  value 0.1uF  [CAP0603]  (hidden comment: CAP 0603)
C27  value 1uF  [CAP0603]  (hidden comment: CAP 0603)
P1  0.100" Sockets  [ESQ-120-44-L-D]
R17  value 4.7k  Do Not Populate: DNP  [RES0603]  (hidden comment: RES 0603)
R18  value 4.7k  Do Not Populate: DNP  [RES0603]  (hidden comment: RES 0603)
U8  RpiB+Footprint-UpsideDown-Direct  Do Not Populate: DNP  [RpiB+UpsideDown-Direct]

### Ports
RPI-3V3, RPI-5VIN, RPI-CS0, RPI-GPIO4, RPI-GPIO5, RPI-GPIO6, RPI-GPIO7, RPI-GPIO12, RPI-GPIO13, RPI-GPIO16, RPI-GPIO17, RPI-GPIO18, RPI-GPIO19, RPI-GPIO20, RPI-GPIO21, RPI-GPIO22, RPI-GPIO23, RPI-GPIO24, RPI-GPIO25, RPI-GPIO26, RPI-GPIO27, RPI-ID-SC, RPI-ID-SD, RPI-MISO, RPI-MOSI, RPI-SCL, RPI-SCLK, RPI-SDA, RPI-UART-RXD, RPI-UART-TXD

### Nets
5V: C26.1 C27.1 P1.2 P1.4 ; port RPI-5VIN
GND: C26.2 C27.2 P1.6 P1.9 P1.14 P1.20 P1.25 P1.30 P1.34 P1.39
RPI-3V3A: P1.1 R17.1 R18.1 ; port RPI-3V3  [project net RPI-3V3]
RPI-3V3B: P1.17
RPI-GPIO4: P1.7 ; port RPI-GPIO4  [project net UI-LED-R]
RPI-GPIO5: P1.29 ; port RPI-GPIO5  [project net UI-LED-Y]
RPI-GPIO6: P1.31 ; port RPI-GPIO6  [project net UI-LED-G]
RPI-GPIO7: P1.26 ; port RPI-GPIO7
RPI-GPIO8: P1.24 ; port RPI-CS0
RPI-GPIO9: P1.21 ; port RPI-MISO
RPI-GPIO10: P1.19 ; port RPI-MOSI
RPI-GPIO11: P1.23 ; port RPI-SCLK
RPI-GPIO12: P1.32 ; port RPI-GPIO12  [project net PB13]
RPI-GPIO13: P1.33 ; port RPI-GPIO13  [project net PB14]
RPI-GPIO16: P1.36 ; port RPI-GPIO16
RPI-GPIO17: P1.11 ; port RPI-GPIO17
RPI-GPIO18: P1.12 ; port RPI-GPIO18
RPI-GPIO19: P1.35 ; port RPI-GPIO19
RPI-GPIO20: P1.38 ; port RPI-GPIO20
RPI-GPIO21: P1.40 ; port RPI-GPIO21
RPI-GPIO22: P1.15 ; port RPI-GPIO22
RPI-GPIO23: P1.16 ; port RPI-GPIO23
RPI-GPIO24: P1.18 ; port RPI-GPIO24
RPI-GPIO25: P1.22 ; port RPI-GPIO25  [project net UI-ID0]
RPI-GPIO26: P1.37 ; port RPI-GPIO26  [project net UI-ID1]
RPI-GPIO27: P1.13 ; port RPI-GPIO27
RPI-ID-SC: P1.28 ; port RPI-ID-SC
RPI-ID-SD: P1.27 ; port RPI-ID-SD
RPI-SCL: P1.5 R17.2 ; port RPI-SCL
RPI-SDA: P1.3 R18.2 ; port RPI-SDA
RPI-UART-RXD: P1.10 ; port RPI-UART-RXD  [project net PB10]
RPI-UART-TXD: P1.8 ; port RPI-UART-TXD  [project net PB11]

### Notes on the sheet
- (near R18) Note: Rpi has onboard I2C pullups
- Project:
- RespiraWorks Ventilator
- Title:
- Sheet:
- of
- Size:
- A4
- Drawn By:
- Revision:
- Date:
- File:
- (in symbol RpiB+Footprint-UpsideDown-Direct) Raspberry Pi B+ Mechanical Footprint; Upside down direct socket; Separately placed ESQ-120-44-L-D; connector required!

### Library data of the parts
C26 = CAP 0603: as C1 on sheet Cycle-Controller; Do Not Populate: *
C27 = CAP 0603: as C2 on sheet Cycle-Controller; Do Not Populate: *
P1 = ESQ-120-44-L-D: Tall Female Header 0.100" Pitch 20x2 Sockets; Manufacturer: Samtec; Manufacturer P/N: ESQ-120-44-L-D; PCB Package: ESQ-120-44-L-D; Tolerance: *; Do Not Populate: *; Value: *
R17 R18 = RES 0603: Manufacturer P/N: RC0603FR-074K7L; Manufacturer: Yageo; PCB Package: 0603; Tolerance: 1%
U8 = RpiB+Footprint-UpsideDown-Direct: Raspberry Pi B+ Footprint direct on PCB; Manufacturer: Raspberry Pi; Manufacturer P/N: B+

## Sheet Sensors.SchDoc: RespiraWorks
size A3; CompanyName: RespiraWorks; DrawnBy: E. Chiu; Organization: Altium; DocumentNumber: 7; Revision: A1; SheetNumber: 7; SheetTotal: 8; PageSetup: Record=PageOptions|CenterHorizontal=True|CenterVertical=True|PrintScale=0.67|XCorrection=1.00|YCorrection=1.00|PrintKind=0|BorderSize=5000000|LeftOffset=0|BottomOffset=0|Orientation=2|PaperLength=1000|PaperWidth=1000|Scale=100|PaperSource=276|PrintQuality=-3|MediaType=1|DitherType=10|PrintScaleMode=1|PaperKind=11"x17" 279.4x431.8mm|PaperIndex=3; ProjectName: FALCON 3S
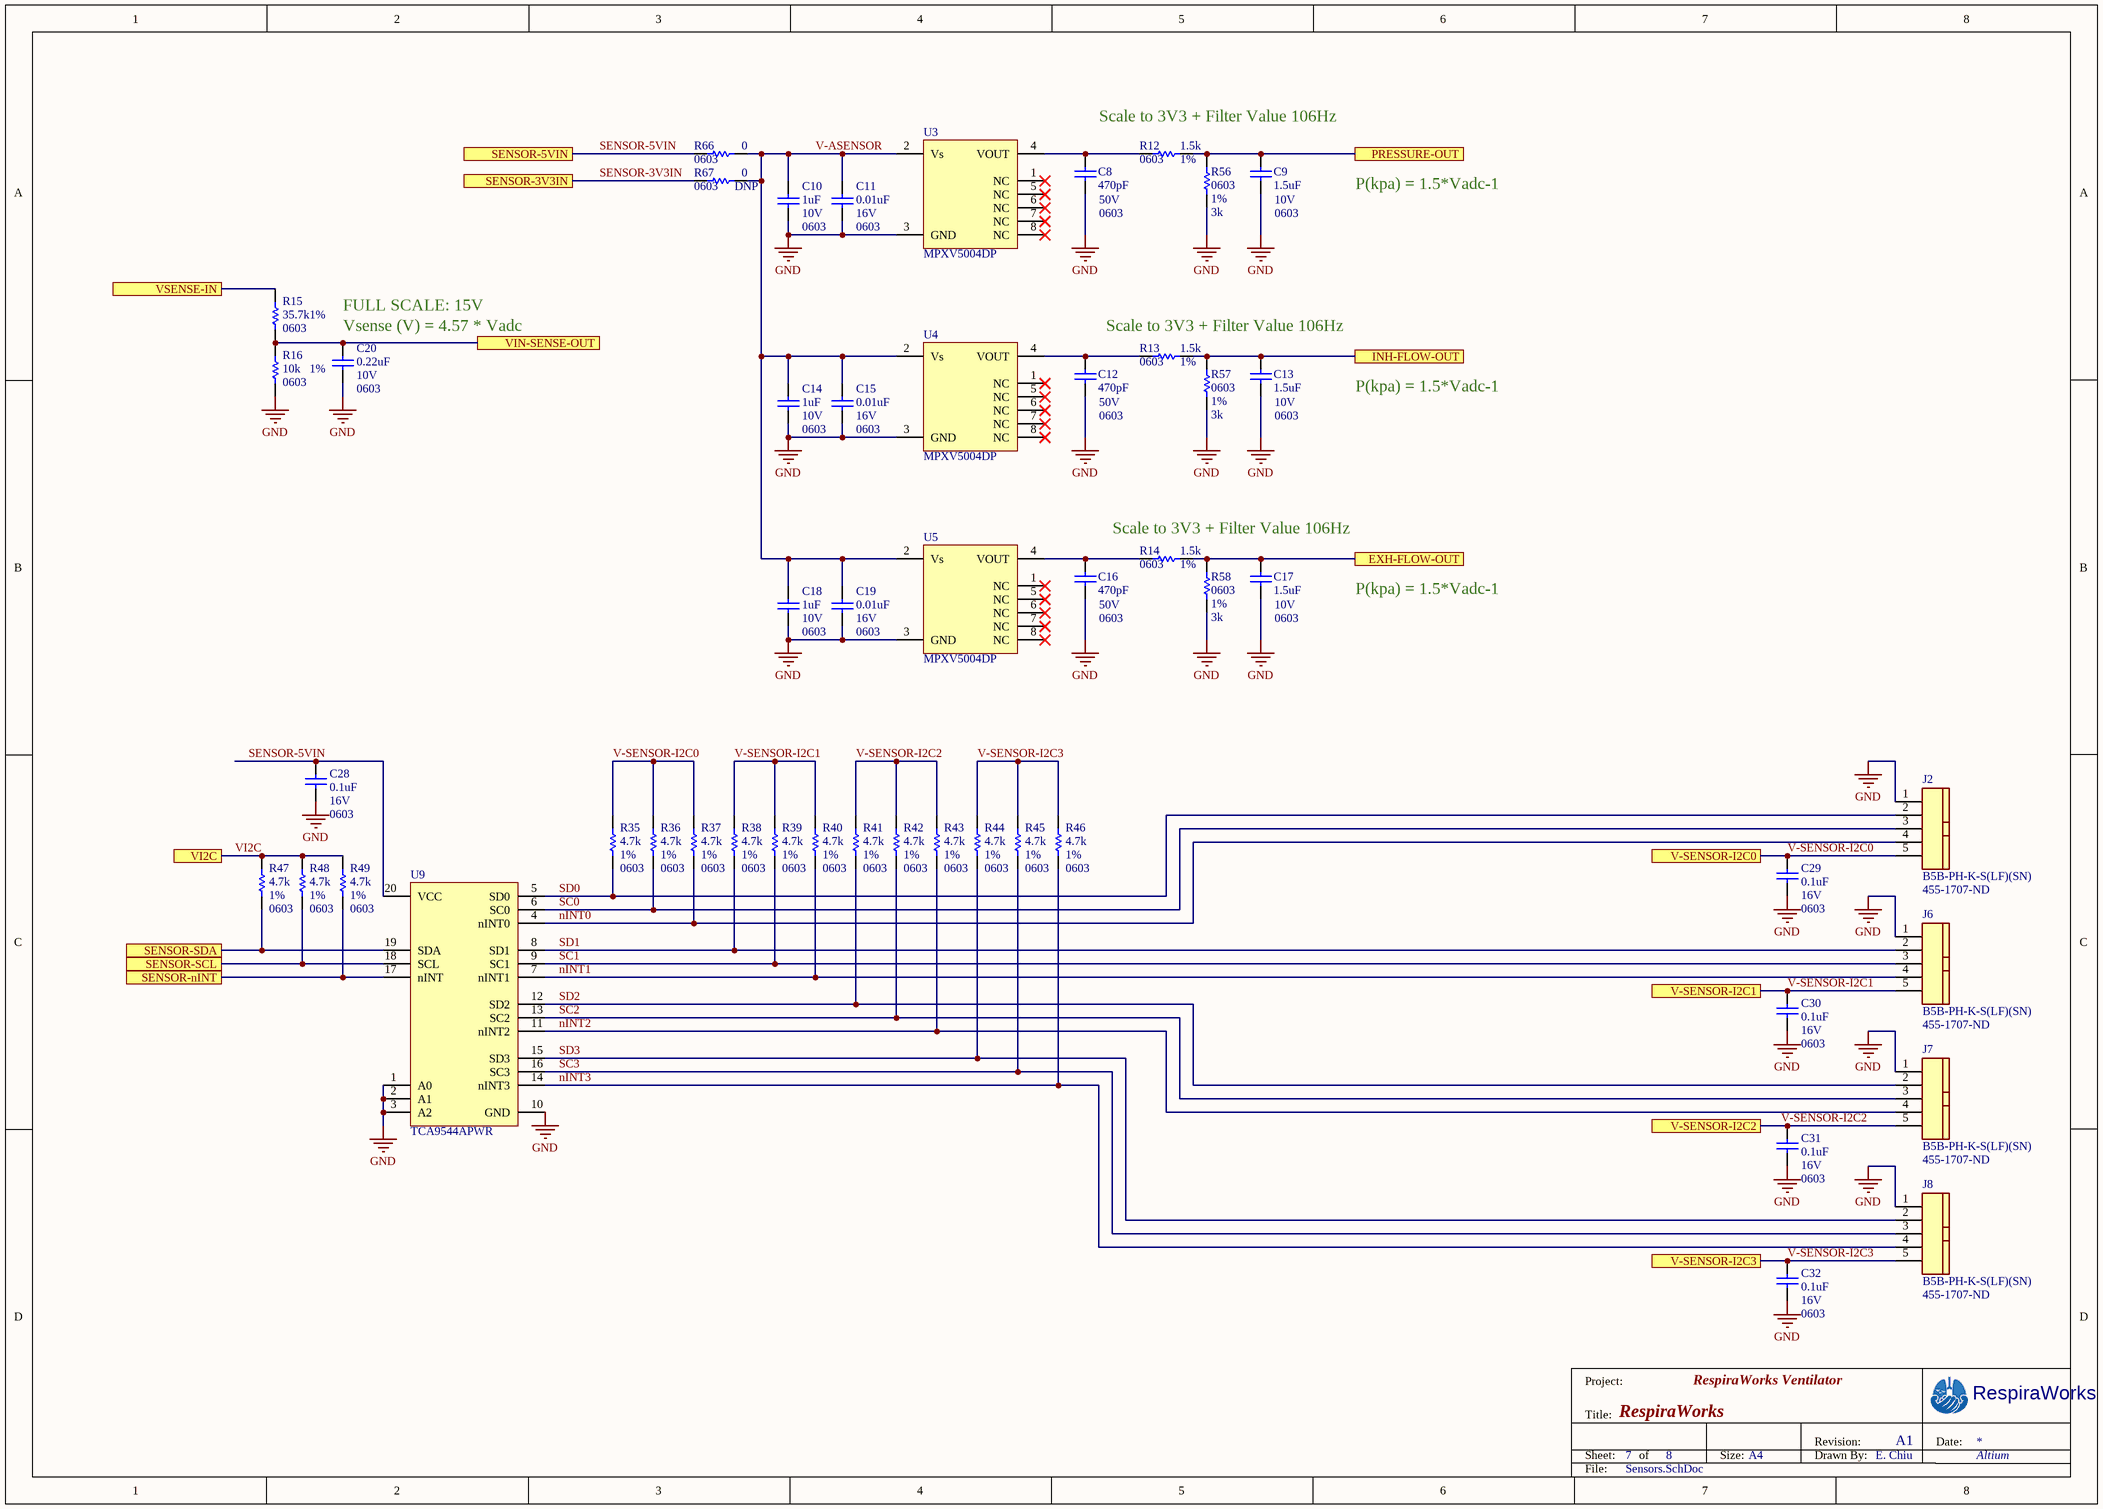
[diagram p3: Sensors.SchDoc]

### Parts
C8  value 470pF  Voltage: 50V  PCB Package: 0603  [CAP0603]  (hidden comment: CAP 0603)
C9  value 1.5uF  Voltage: 10V  PCB Package: 0603  [CAP0603]  (hidden comment: CAP 0603)
C10  value 1uF  Voltage: 10V  PCB Package: 0603  [CAP0603]  (hidden comment: CAP 0603)
C11  value 0.01uF  Voltage: 16V  PCB Package: 0603  [CAP0603]  (hidden comment: CAP 0603)
C12  value 470pF  Voltage: 50V  PCB Package: 0603  [CAP0603]  (hidden comment: CAP 0603)
C13  value 1.5uF  Voltage: 10V  PCB Package: 0603  [CAP0603]  (hidden comment: CAP 0603)
C14  value 1uF  Voltage: 10V  PCB Package: 0603  [CAP0603]  (hidden comment: CAP 0603)
C15  value 0.01uF  Voltage: 16V  PCB Package: 0603  [CAP0603]  (hidden comment: CAP 0603)
C16  value 470pF  Voltage: 50V  PCB Package: 0603  [CAP0603]  (hidden comment: CAP 0603)
C17  value 1.5uF  Voltage: 10V  PCB Package: 0603  [CAP0603]  (hidden comment: CAP 0603)
C18  value 1uF  Voltage: 10V  PCB Package: 0603  [CAP0603]  (hidden comment: CAP 0603)
C19  value 0.01uF  Voltage: 16V  PCB Package: 0603  [CAP0603]  (hidden comment: CAP 0603)
C20  value 0.22uF  Voltage: 10V  PCB Package: 0603  [CAP0603]  (hidden comment: CAP 0603)
C28  value 0.1uF  Voltage: 16V  PCB Package: 0603  [CAP0603]  (hidden comment: CAP 0603)
C29  value 0.1uF  Voltage: 16V  PCB Package: 0603  [CAP0603]  (hidden comment: CAP 0603)
C30  value 0.1uF  Voltage: 16V  PCB Package: 0603  [CAP0603]  (hidden comment: CAP 0603)
C31  value 0.1uF  Voltage: 16V  PCB Package: 0603  [CAP0603]  (hidden comment: CAP 0603)
C32  value 0.1uF  Voltage: 16V  PCB Package: 0603  [CAP0603]  (hidden comment: CAP 0603)
J2  B5B-PH-K-S(LF)(SN)  Supplier Part Number 1: 455-1707-ND  [JST_B5B-XH-AM]
J6  B5B-PH-K-S(LF)(SN)  Supplier Part Number 1: 455-1707-ND  [JST_B5B-XH-AM]
J7  B5B-PH-K-S(LF)(SN)  Supplier Part Number 1: 455-1707-ND  [JST_B5B-XH-AM]
J8  B5B-PH-K-S(LF)(SN)  Supplier Part Number 1: 455-1707-ND  [JST_B5B-XH-AM]
R12  value 1.5k  PCB Package: 0603  Tolerance: 1%  [RES0603]  (hidden comment: RES 0603)
R13  value 1.5k  PCB Package: 0603  Tolerance: 1%  [RES0603]  (hidden comment: RES 0603)
R14  value 1.5k  PCB Package: 0603  Tolerance: 1%  [RES0603]  (hidden comment: RES 0603)
R15  value 35.7k  PCB Package: 0603  Tolerance: 1%  [RES0603]  (hidden comment: RES 0603)
R16  value 10k  PCB Package: 0603  Tolerance: 1%  [RES0603]  (hidden comment: RES 0603)
R35  value 4.7k  PCB Package: 0603  Tolerance: 1%  [RES0603]  (hidden comment: RES 0603)
R36  value 4.7k  PCB Package: 0603  Tolerance: 1%  [RES0603]  (hidden comment: RES 0603)
R37  value 4.7k  PCB Package: 0603  Tolerance: 1%  [RES0603]  (hidden comment: RES 0603)
R38  value 4.7k  PCB Package: 0603  Tolerance: 1%  [RES0603]  (hidden comment: RES 0603)
R39  value 4.7k  PCB Package: 0603  Tolerance: 1%  [RES0603]  (hidden comment: RES 0603)
R40  value 4.7k  PCB Package: 0603  Tolerance: 1%  [RES0603]  (hidden comment: RES 0603)
R41  value 4.7k  PCB Package: 0603  Tolerance: 1%  [RES0603]  (hidden comment: RES 0603)
R42  value 4.7k  PCB Package: 0603  Tolerance: 1%  [RES0603]  (hidden comment: RES 0603)
R43  value 4.7k  PCB Package: 0603  Tolerance: 1%  [RES0603]  (hidden comment: RES 0603)
R44  value 4.7k  PCB Package: 0603  Tolerance: 1%  [RES0603]  (hidden comment: RES 0603)
R45  value 4.7k  PCB Package: 0603  Tolerance: 1%  [RES0603]  (hidden comment: RES 0603)
R46  value 4.7k  PCB Package: 0603  Tolerance: 1%  [RES0603]  (hidden comment: RES 0603)
R47  value 4.7k  PCB Package: 0603  Tolerance: 1%  [RES0603]  (hidden comment: RES 0603)
R48  value 4.7k  PCB Package: 0603  Tolerance: 1%  [RES0603]  (hidden comment: RES 0603)
R49  value 4.7k  PCB Package: 0603  Tolerance: 1%  [RES0603]  (hidden comment: RES 0603)
R56  value 3k  PCB Package: 0603  Tolerance: 1%  [RES0603]  (hidden comment: RES 0603)
R57  value 3k  PCB Package: 0603  Tolerance: 1%  [RES0603]  (hidden comment: RES 0603)
R58  value 3k  PCB Package: 0603  Tolerance: 1%  [RES0603]  (hidden comment: RES 0603)
R66  value 0  PCB Package: 0603  [RES0603]  (hidden comment: RES 0603)
R67  value 0  PCB Package: 0603  Do Not Populate: DNP  [RES0603]  (hidden comment: RES 0603)
U3  MPXV5004DP  [8-SOP-MPXV]
U4  MPXV5004DP  [8-SOP-MPXV]
U5  MPXV5004DP  [8-SOP-MPXV]
U9  TCA9544APWR  [20-pw]

### Ports
EXH-FLOW-OUT, INH-FLOW-OUT, PRESSURE-OUT, SENSOR-3V3IN, SENSOR-5VIN, SENSOR-nINT, SENSOR-SCL, SENSOR-SDA, V-SENSOR-I2C0, V-SENSOR-I2C1, V-SENSOR-I2C2, V-SENSOR-I2C3, VI2C, VIN-SENSE-OUT, VSENSE-IN

### Nets
12V: R15.2 ; port VSENSE-IN
GND: C8.1 C9.1 C10.2 C11.2 C12.1 C13.1 C14.2 C15.2 C16.1 C17.1 C18.2 C19.2 C20.1 C28.2 C29.2 C30.2 C31.2 C32.2 J2.1 J6.1 J7.1 J8.1 R16.1 R56.1 R57.1 R58.1 U3.3(GND) U4.3(GND) U5.3(GND) U9.1(A0) U9.2(A1) U9.3(A2) U9.10(GND)
SENSOR-3V3IN: R47.2 R48.2 R49.2 R67.1 ; port VI2C, port SENSOR-3V3IN  [also labelled VI2C]  [project net CC-3V3]
SENSOR-5VIN: C28.1 R66.1 U9.20(VCC) ; port SENSOR-5VIN  [project net 5V]
CC-I2C-INT: R49.1 U9.17(nINT) ; port SENSOR-nINT
CC-SCL: R48.1 U9.18(SCL) ; port SENSOR-SCL
CC-SDA: R47.1 U9.19(SDA) ; port SENSOR-SDA
EXH-FLOW-OUT: C17.2 R14.2 R58.2 ; port EXH-FLOW-OUT
INH-FLOW-OUT: C13.2 R13.2 R57.2 ; port INH-FLOW-OUT
nINT0: J2.4 R37.1 U9.4(nINT0)
nINT1: J6.4 R40.1 U9.7(nINT1)
nINT2: J7.4 R43.1 U9.11(nINT2)
nINT3: J8.4 R46.1 U9.14(nINT3)
PRESSURE-OUT: C9.2 R12.2 R56.2 ; port PRESSURE-OUT
SC0: J2.3 R36.1 U9.6(SC0)
SC1: J6.3 R39.1 U9.9(SC1)
SC2: J7.3 R42.1 U9.13(SC2)
SC3: J8.3 R45.1 U9.16(SC3)
SD0: J2.2 R35.1 U9.5(SD0)
SD1: J6.2 R38.1 U9.8(SD1)
SD2: J7.2 R41.1 U9.12(SD2)
SD3: J8.2 R44.1 U9.15(SD3)
V-ASENSOR: C10.1 C11.1 C14.1 C15.1 C18.1 C19.1 R66.2 R67.2 U3.2(Vs) U4.2(Vs) U5.2(Vs)
V-SENSOR-I2C0: C29.1 J2.5 R35.2 R36.2 R37.2 ; port V-SENSOR-I2C0
V-SENSOR-I2C1: C30.1 J6.5 R38.2 R39.2 R40.2 ; port V-SENSOR-I2C1
V-SENSOR-I2C2: C31.1 J7.5 R41.2 R42.2 R43.2 ; port V-SENSOR-I2C2
V-SENSOR-I2C3: C32.1 J8.5 R44.2 R45.2 R46.2 ; port V-SENSOR-I2C3
VIN-SENSE-OUT: C20.2 R15.1 R16.2 ; port VIN-SENSE-OUT
NetC8_2: C8.2 R12.1 U3.4(VOUT)
NetC12_2: C12.2 R13.1 U4.4(VOUT)
NetC16_2: C16.2 R14.1 U5.4(VOUT)

Not connected (* = marked no-connect by the designer): U3 1(NC)* 5(NC)* 6(NC)* 7(NC)* 8(NC)*; U4 1(NC)* 5(NC)* 6(NC)* 7(NC)* 8(NC)*; U5 1(NC)* 5(NC)* 6(NC)* 7(NC)* 8(NC)*

### Notes on the sheet
- Scale to 3V3 + Filter Value 106Hz
- P(kpa) = 1.5*Vadc-1
- (near C20) FULL SCALE: 15V
- (near C20) Vsense (V) = 4.57 * Vadc
- Project:
- RespiraWorks Ventilator
- Title:
- Sheet:
- of
- Size:
- A4
- Drawn By:
- Revision:
- Date:
- File:

### Library data of the parts
C8 C12 C16 = CAP 0603: Manufacturer P/N: CC0603MRX7R9BB471; Manufacturer: Yageo; Type: X7R; Do Not Populate: *
C9 C13 C17 = CAP 0603: Manufacturer P/N: C1608X7R1A155K080AC; Manufacturer: TDK; Type: X7R; Do Not Populate: *
C10 C14 C18 = CAP 0603: as C23 on sheet Cycle-Controller; Do Not Populate: *
C11 C15 C19 = CAP 0603: Manufacturer P/N: CL10B103KO8NNNC; Manufacturer: Samsung; Type: X7R; Do Not Populate: *
C20 = CAP 0603: Manufacturer P/N: CAP CER 0.22UF 10V X7R 0603; Manufacturer: Yageo; Type: X7R; Do Not Populate: *
C28-C32 = CAP 0603: as C24 on sheet Cycle-Controller; Do Not Populate: *
J2 J6-J8 = B5B-PH-K-S(LF)(SN): CONN HEADER PH TOP 5POS 2MM; Manufacturer: JST Sales America Inc.; Connector Type: Header, Shrouded; Number of Positions: 5; Number of Positions Loaded: All; Pitch: 0.079" (2.00mm); Supplier 1: Digi-Key; Manufacturer Part Number: B5B-PH-K-S(LF)(SN); RoHS: RoHS Compliant; Category: Connectors, Interconnects; Stock 1: 20730; Pricing 1: 1=0.29, 10=0.274, 100=0.1918, 500=0.16438, 1000=0.13699, 5000=0.11742, 10000=0.10959 (USD); Packaging: Bulk; Part Status: Active; Contact Type: Male Pin; Number of Rows: 1; Row Spacing: -; Contact Mating Length: 0.130" (3.30mm); Mounting Type: Through Hole; Termination: Press-Fit, Solder; Fastening Type: Detent Lock; Features: -; Contact Finish: Tin; Contact Finish Thickness: -; Color: Natural; ComponentLink1URL: http://www.jst-mfg.com/product/pdf/eng/ePH.pdf; ComponentLink1Description: http://www.jst-mfg.com/product/pdf/eng/ePH.pdf; Manufacturer P/N: B5B-PH-K-S(LF)(SN)
R12-R14 = RES 0603: Manufacturer P/N: RC0603FR-071K5L; Manufacturer: Yageo; Do Not Populate: *
R15 = RES 0603: Manufacturer P/N: RC0603FR-0735K7L; Manufacturer: Yageo; Do Not Populate: *
R16 = RES 0603: Manufacturer P/N: RC0603FR-0710KL; Manufacturer: Yageo; Do Not Populate: *
R35-R49 = RES 0603: Manufacturer P/N: RC0603FR-074K7L; Manufacturer: Yageo; Do Not Populate: *
R56-R58 = RES 0603: Manufacturer P/N: RC0603FR-073KL; Manufacturer: Yageo; Do Not Populate: *
R66 R67 = RES 0603: as R1 on sheet TOP
  R66: Do Not Populate: *
U3-U5 = MPXV5004DP: Pressure Sensor 0.57PSI (3.92kPa) Differential Male - 0.13" (3.3mm) Tube, Dual 1 V ~ 4.9 V 8-BSOP (0.475", 12.06mm Width) Dual Ports, Same Side; Manufacturer: NXP; Do Not Populate: *; PCB Package: 8-SOP-MPXV; Manufacturer P/N: MPXV5004DP
U9 = TCA9544APWR: IC I2C SW 4CH W/RESET 20TSSOP; Manufacturer: Texas Instruments; PCB Package: 20-TSSOP; Do Not Populate: *; Manufacturer P/N: TCA9544APWR

## Sheet Switches.SchDoc: RespiraWorks
size A3; CompanyName: RespiraWorks; DrawnBy: E. Chiu; Organization: Altium; DocumentNumber: 8; Revision: A1; SheetNumber: 8; SheetTotal: 8; PageSetup: Record=PageOptions|CenterHorizontal=True|CenterVertical=True|PrintScale=0.67|XCorrection=1.00|YCorrection=1.00|PrintKind=0|BorderSize=5000000|LeftOffset=0|BottomOffset=0|Orientation=2|PaperLength=1000|PaperWidth=1000|Scale=100|PaperSource=276|PrintQuality=-3|MediaType=1|DitherType=10|PrintScaleMode=1|PaperKind=11"x17" 279.4x431.8mm|PaperIndex=3; ProjectName: FALCON 3S
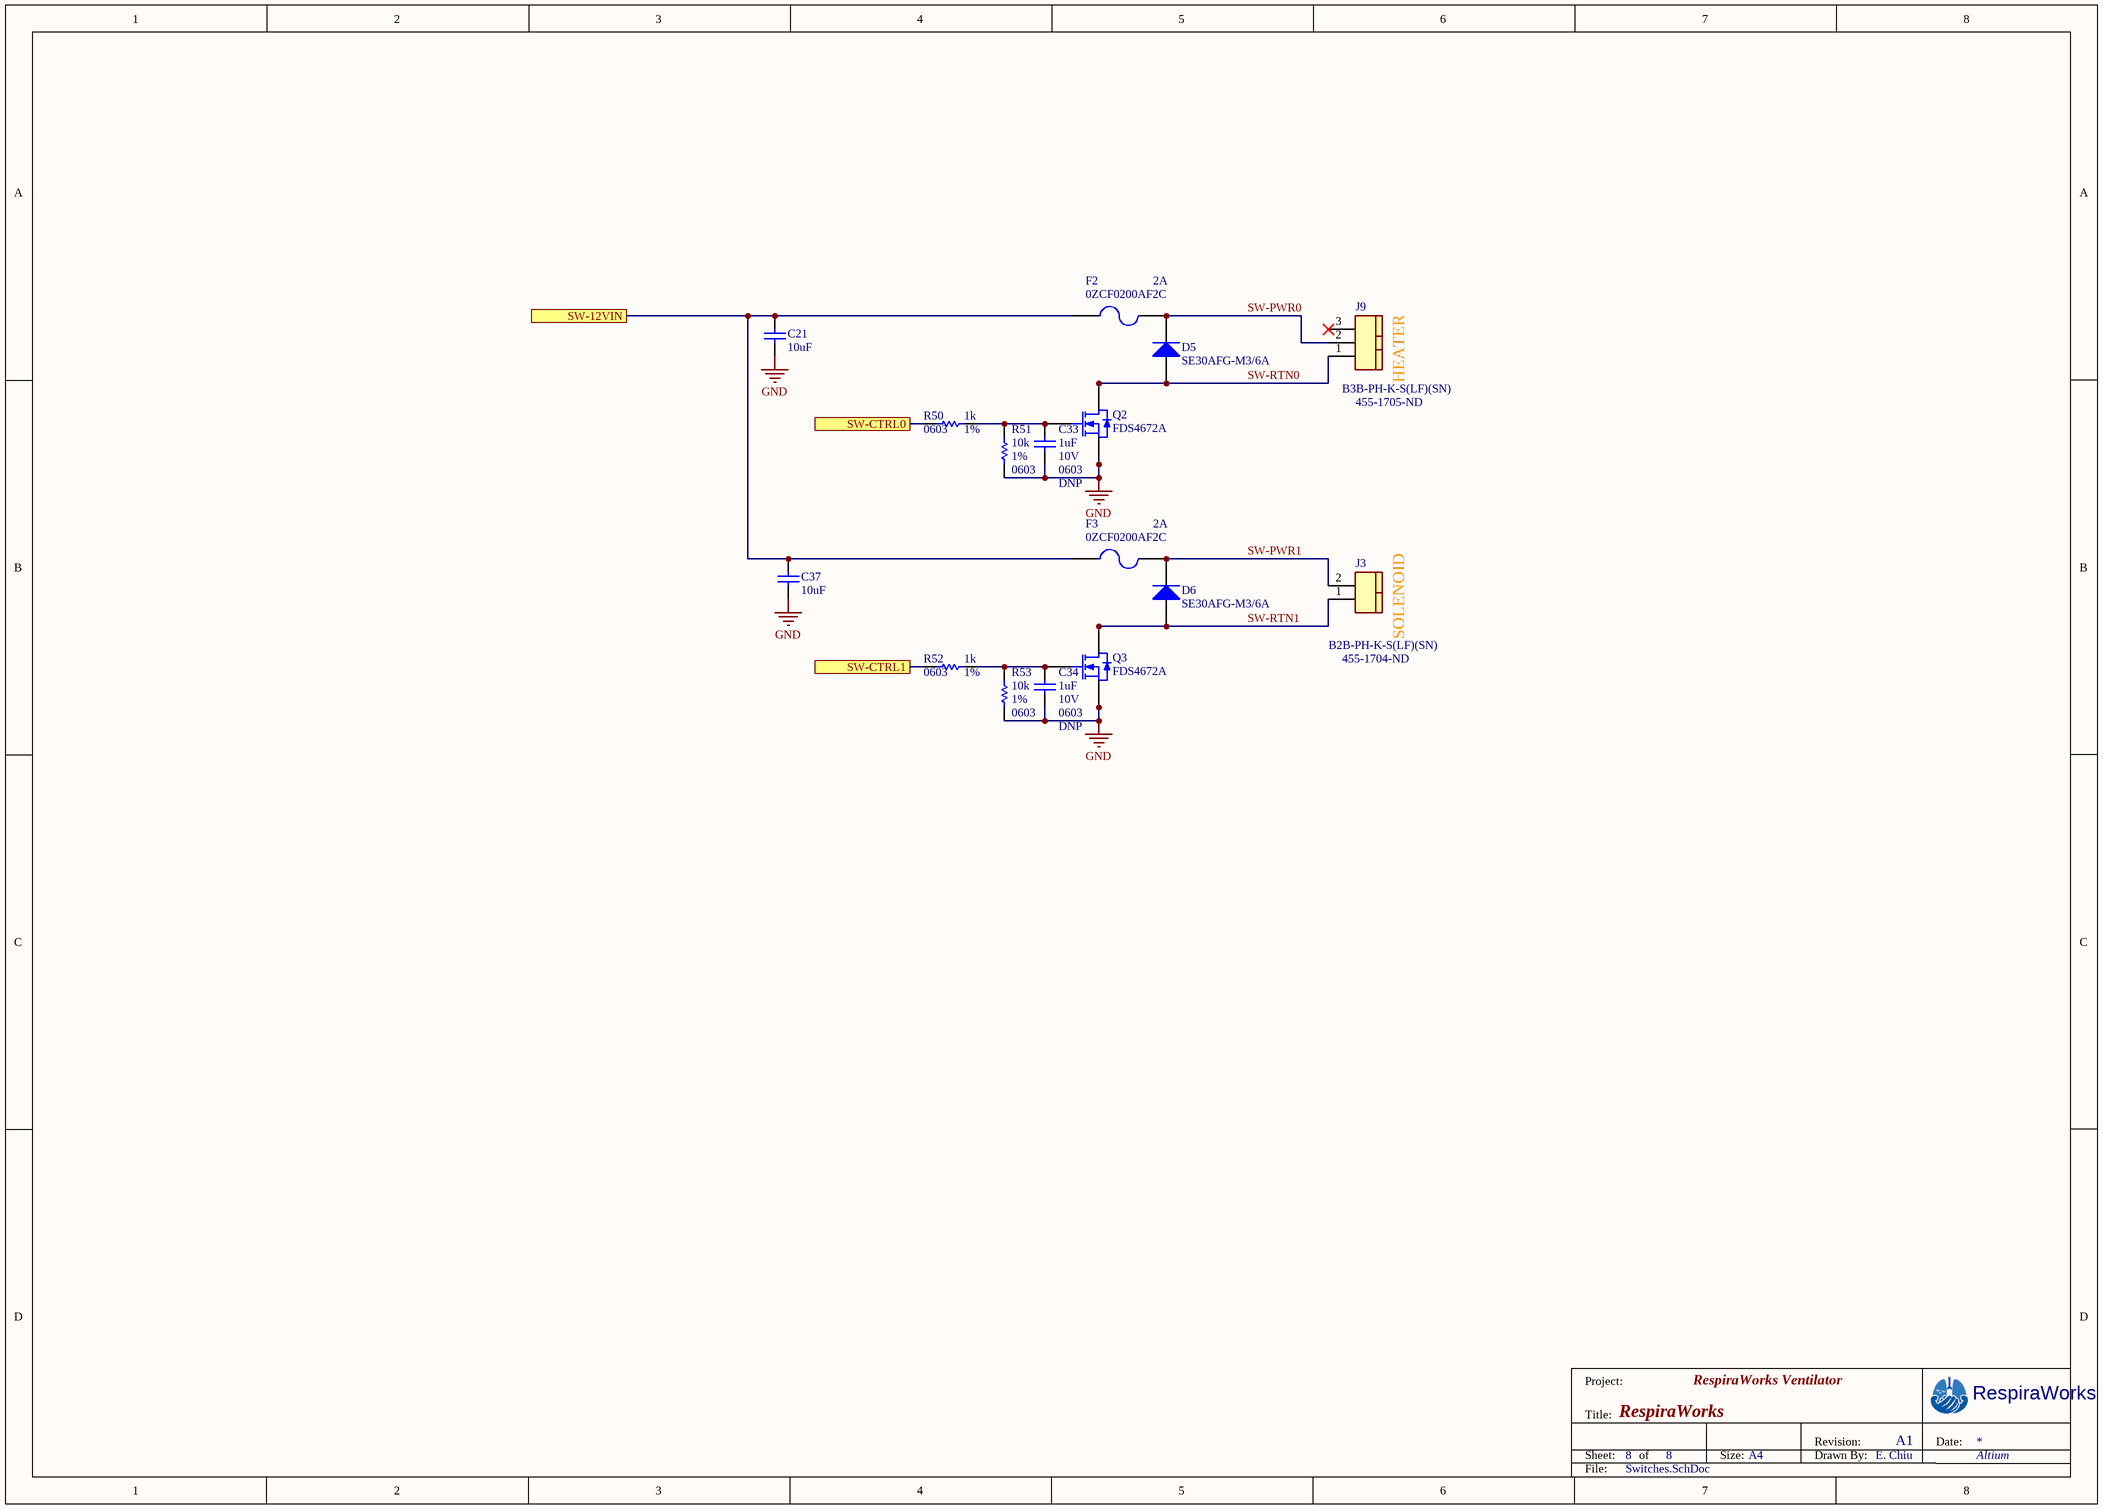
[diagram p4: Switches.SchDoc]

### Parts
C21  value 10uF  [CAP1210]  (hidden comment: CAP 1210)
C33  value 1uF  Voltage: 10V  PCB Package: 0603  Do Not Populate: DNP  [CAP0603]  (hidden comment: CAP 0603)
C34  value 1uF  Voltage: 10V  PCB Package: 0603  Do Not Populate: DNP  [CAP0603]  (hidden comment: CAP 0603)
C37  value 10uF  [CAP1210]  (hidden comment: CAP 1210)
D5  SE30AFG-M3/6A  [DO-214AC]
D6  SE30AFG-M3/6A  [DO-214AC]
F2  I(hold): 2A  [FUSE2920]  (hidden comment: 0ZCF0200AF2C)
F3  I(hold): 2A  [FUSE2920]  (hidden comment: 0ZCF0200AF2C)
J3  B2B-PH-K-S(LF)(SN)  Supplier Part Number 1: 455-1704-ND  [JST_B2B-XH-AM]
J9  B3B-PH-K-S(LF)(SN)  Supplier Part Number 1: 455-1705-ND  [JST_B3B-XH-AM]
Q2  FDS4672A  [8-SOIC]
Q3  FDS4672A  [8-SOIC]
R50  value 1k  PCB Package: 0603  Tolerance: 1%  [RES0603]  (hidden comment: RES 0603)
R51  value 10k  PCB Package: 0603  Tolerance: 1%  [RES0603]  (hidden comment: RES 0603)
R52  value 1k  PCB Package: 0603  Tolerance: 1%  [RES0603]  (hidden comment: RES 0603)
R53  value 10k  PCB Package: 0603  Tolerance: 1%  [RES0603]  (hidden comment: RES 0603)

### Ports
SW-12VIN, SW-CTRL0, SW-CTRL1

### Nets
12V: C21.2 C37.2 F2.1 F3.1 ; port SW-12VIN
GND: C21.1 C33.2 C34.2 C37.1 Q2.1(S) Q2.2(S) Q2.3(S) Q3.1(S) Q3.2(S) Q3.3(S) R51.2 R53.2
HEATER-CTRL: R50.2 ; port SW-CTRL0
SOLENOID-CTRL: R52.2 ; port SW-CTRL1
SW-PWR0: D5.K F2.2 J9.2
SW-PWR1: D6.K F3.2 J3.2
SW-RTN0: D5.A J9.1 Q2.5(D) Q2.6(D) Q2.7(D) Q2.8(D)
SW-RTN1: D6.A J3.1 Q3.5(D) Q3.6(D) Q3.7(D) Q3.8(D)
NetC33_1: C33.1 Q2.4(G) R50.1 R51.1
NetC34_1: C34.1 Q3.4(G) R52.1 R53.1

Not connected (* = marked no-connect by the designer): J9 3*

### Notes on the sheet
- (near J9) HEATER
- (near J3) SOLENOID
- Project:
- RespiraWorks Ventilator
- Title:
- Sheet:
- of
- Size:
- A4
- Drawn By:
- Revision:
- Date:
- File:

### Library data of the parts
C21 C37 = CAP 1210: Manufacturer P/N: GRM32DR71E106KA12L; Manufacturer: Murata; Voltage: 25V; PCB Package: 1210; Type: X7R; Do Not Populate: *
C33 C34 = CAP 0603: as C23 on sheet Cycle-Controller
D5 D6 = SE30AFG-M3/6A: Ultra-Fast Signal Diode, Silicon, 100V, 300mA; Manufacturer: Vishay; Type: GP Standard Recovery; Reverse Voltage: 400V; I(max): 3A; PCB Package: DO-221AC, SMA Flat Leads; Do Not Populate: *; Manufacturer P/N: SE30AFG-M3/6A
F2 F3 = 0ZCF0200AF2C: PTC Fuse, 2A Hold, 24V, 2920 size; Manufacturer: Belfuse; I(trip): 4A; PCB Package: 2920; Manufacturer P/N: 0ZCF0200AF2C; Do Not Populate: *; V(max): 24V
J3 = B2B-PH-K-S(LF)(SN): CONN HEADER PH TOP 2POS 2MM; Manufacturer: JST Sales America Inc.; Connector Type: Header, Shrouded; Number of Positions: 2; Number of Positions Loaded: All; Pitch: 0.079" (2.00mm); Supplier 1: Digi-Key; Manufacturer Part Number: B2B-PH-K-S(LF)(SN); RoHS: RoHS Compliant; Category: Connectors, Interconnects; Stock 1: 207967; Pricing 1: 1=0.17, 10=0.162, 100=0.1002, 500=0.08288, 1000=0.07252, 5000=0.06216, 10000=0.06044 (USD); Packaging: Bulk; Part Status: Active; Contact Type: Male Pin; Number of Rows: 1; Row Spacing: -; Contact Mating Length: 0.130" (3.30mm); Mounting Type: Through Hole; Termination: Press-Fit, Solder; Fastening Type: Detent Lock; Features: -; Contact Finish: Tin; Contact Finish Thickness: -; Color: Natural; ComponentLink1URL: http://www.jst-mfg.com/product/pdf/eng/ePH.pdf; ComponentLink1Description: http://www.jst-mfg.com/product/pdf/eng/ePH.pdf; Manufacturer P/N: B2B-PH-K-S(LF)(SN)
J9 = B3B-PH-K-S(LF)(SN): CONN HEADER PH TOP 3POS 2MM; Manufacturer: JST Sales America Inc.; Connector Type: Header, Shrouded; Number of Positions: 3; Number of Positions Loaded: All; Pitch: 0.079" (2.00mm); Supplier 1: Digi-Key; Manufacturer Part Number: B3B-PH-K-S(LF)(SN); RoHS: RoHS Compliant; Category: Connectors, Interconnects; Stock 1: 55340; Pricing 1: 1=0.19, 10=0.182, 100=0.1262, 500=0.10676, 1000=0.08736, 5000=0.07765, 10000=0.07037 (USD); Packaging: Bulk; Part Status: Active; Contact Type: Male Pin; Number of Rows: 1; Row Spacing: -; Contact Mating Length: 0.130" (3.30mm); Mounting Type: Through Hole; Termination: Press-Fit, Solder; Fastening Type: Detent Lock; Features: -; Contact Finish: Tin; Contact Finish Thickness: -; Color: Natural; ComponentLink1URL: http://www.jst-mfg.com/product/pdf/eng/ePH.pdf; ComponentLink1Description: http://www.jst-mfg.com/product/pdf/eng/ePH.pdf; Manufacturer P/N: B3B-PH-K-S(LF)(SN)
Q2 Q3 = FDS4672A: Transistor, BJT NPN, General Purpose 40V; Manufacturer: On Semi; Vds(max): 60V; Ic(max): 11A; Rds_on: 13mohm; PCB Package: 8-SOIC; Manufacturer P/N: FDS4672A
R50 R52 = RES 0603: Manufacturer P/N: RC0603FR-071KL; Manufacturer: Yageo; Do Not Populate: *
R51 R53 = RES 0603: as R16 on sheet Sensors; Do Not Populate: *

## Sheet Watchdog.SchDoc: RespiraWorks
size A3; CompanyName: RespiraWorks; DrawnBy: E. Chiu; Organization: Altium; DocumentNumber: 5; Revision: A1; SheetNumber: 5; SheetTotal: 8; PageSetup: Record=PageOptions|CenterHorizontal=True|CenterVertical=True|PrintScale=0.67|XCorrection=1.00|YCorrection=1.00|PrintKind=0|BorderSize=5000000|LeftOffset=0|BottomOffset=0|Orientation=2|PaperLength=1000|PaperWidth=1000|Scale=100|PaperSource=276|PrintQuality=-3|MediaType=1|DitherType=10|PrintScaleMode=1|PaperKind=11"x17" 279.4x431.8mm|PaperIndex=3; ProjectName: FALCON 3S
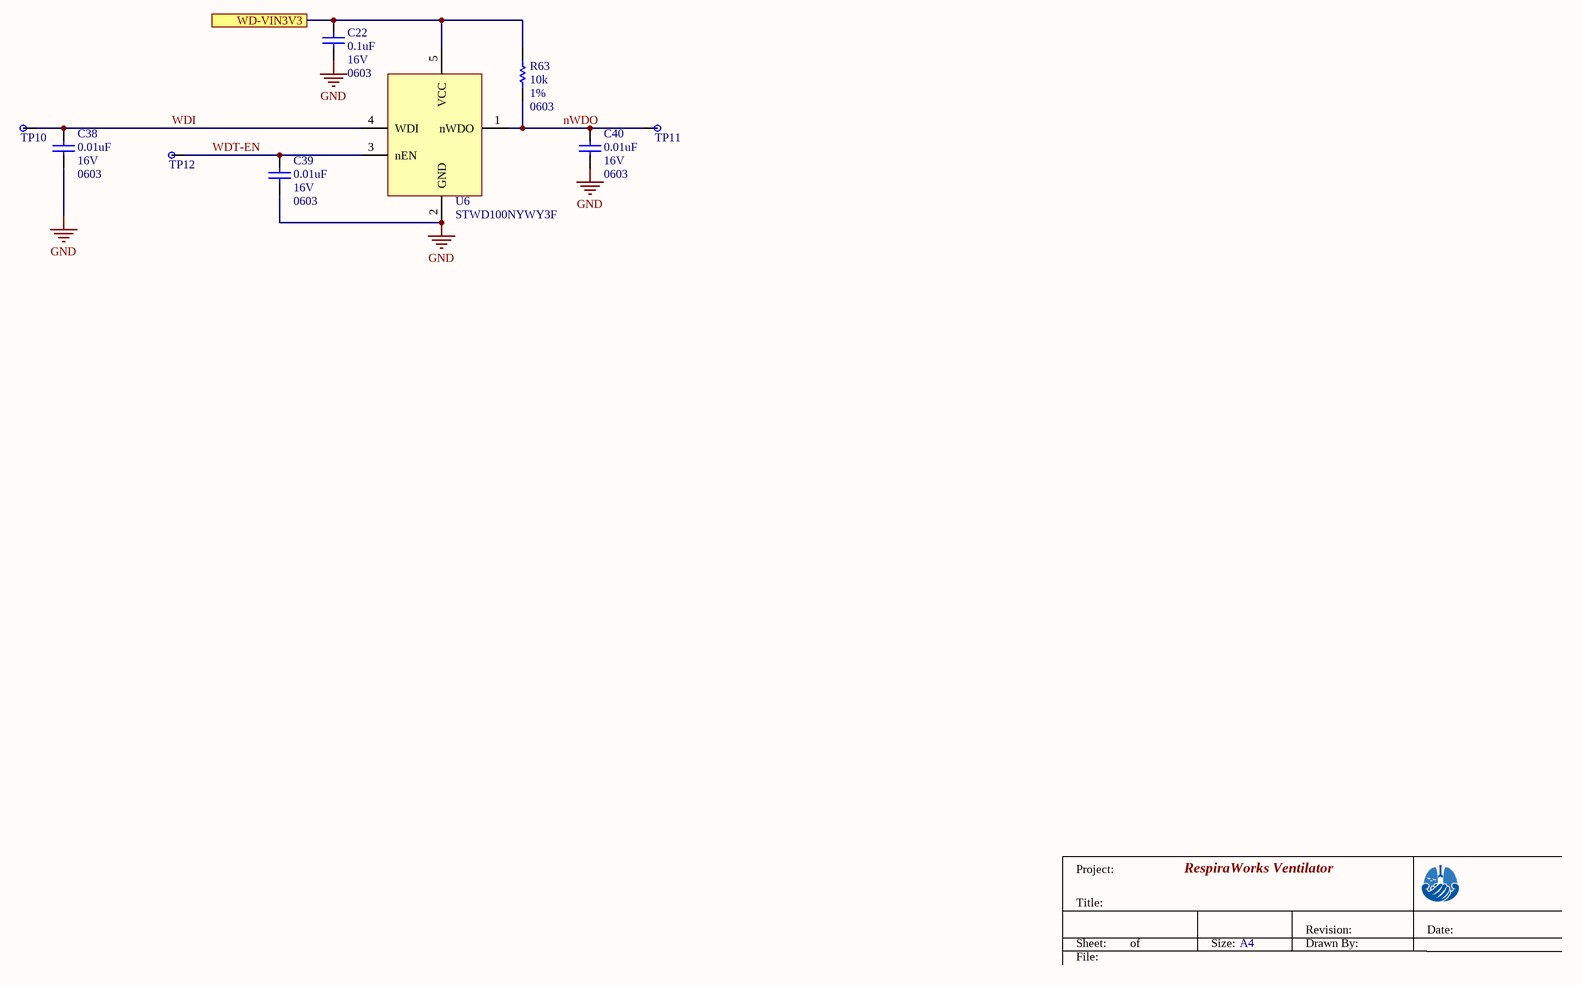
[diagram p5: Watchdog.SchDoc]

### Parts
C22  value 0.1uF  Voltage: 16V  PCB Package: 0603  [CAP0603]  (hidden comment: CAP 0603)
C38  value 0.01uF  Voltage: 16V  PCB Package: 0603  [CAP0603]  (hidden comment: CAP 0603)
C39  value 0.01uF  Voltage: 16V  PCB Package: 0603  [CAP0603]  (hidden comment: CAP 0603)
C40  value 0.01uF  Voltage: 16V  PCB Package: 0603  [CAP0603]  (hidden comment: CAP 0603)
R63  value 10k  PCB Package: 0603  Tolerance: 1%  [RES0603]  (hidden comment: RES 0603)
TP10  TP-SMT  [TP-5015]  (value not drawn)
TP11  TP-SMT  [TP-5015]  (value not drawn)
TP12  TP-SMT  [TP-5015]  (value not drawn)
U6  STWD100NYWY3F  [5-SOT23]

### Ports
WD-VIN3V3

### Nets
CC-3V3: C22.1 R63.2 U6.5(VCC) ; port WD-VIN3V3
GND: C22.2 C38.2 C39.2 C40.2 U6.2(GND)
nWDO: C40.1 R63.1 TP11.1 U6.1(nWDO)
WDI: C38.1 TP10.1 U6.4(WDI)
WDT-EN: C39.1 TP12.1 U6.3(nEN)

### Notes on the sheet
- Project:
- RespiraWorks Ventilator
- Title:
- Sheet:
- of
- Size:
- A4
- Drawn By:
- Revision:
- Date:
- File:

### Library data of the parts
C22 = CAP 0603: as C24 on sheet Cycle-Controller; Do Not Populate: *
C38-C40 = CAP 0603: as C11 on sheet Sensors; Do Not Populate: *
R63 = RES 0603: as R59 on sheet TOP; Do Not Populate: *
TP10-TP12 = TP-SMT: as TP1 on sheet TOP; Manufacturer: Keystone; PCB Package: TP-5015; Tolerance: 5015; Do Not Populate: *; Value: *
U6 = STWD100NYWY3F: Watchdog Timer Circuit, 1.6s timeout; Manufacturer: ST; PCB Package: SOT-23-5; Manufacturer P/N: STWD100NYWY3F; Timeout: 1.6s; Do Not Populate: *

## Sheet Alarms.SchDoc: RespiraWorks
size A3; CompanyName: RespiraWorks; DrawnBy: E. Chiu; Organization: Altium; DocumentNumber: 6; Revision: A1; SheetNumber: 6; SheetTotal: 8; PageSetup: Record=PageOptions|CenterHorizontal=True|CenterVertical=True|PrintScale=0.67|XCorrection=1.00|YCorrection=1.00|PrintKind=0|BorderSize=5000000|LeftOffset=0|BottomOffset=0|Orientation=2|PaperLength=1000|PaperWidth=1000|Scale=100|PaperSource=276|PrintQuality=-3|MediaType=1|DitherType=10|PrintScaleMode=1|PaperKind=11"x17" 279.4x431.8mm|PaperIndex=3; ProjectName: FALCON 3S
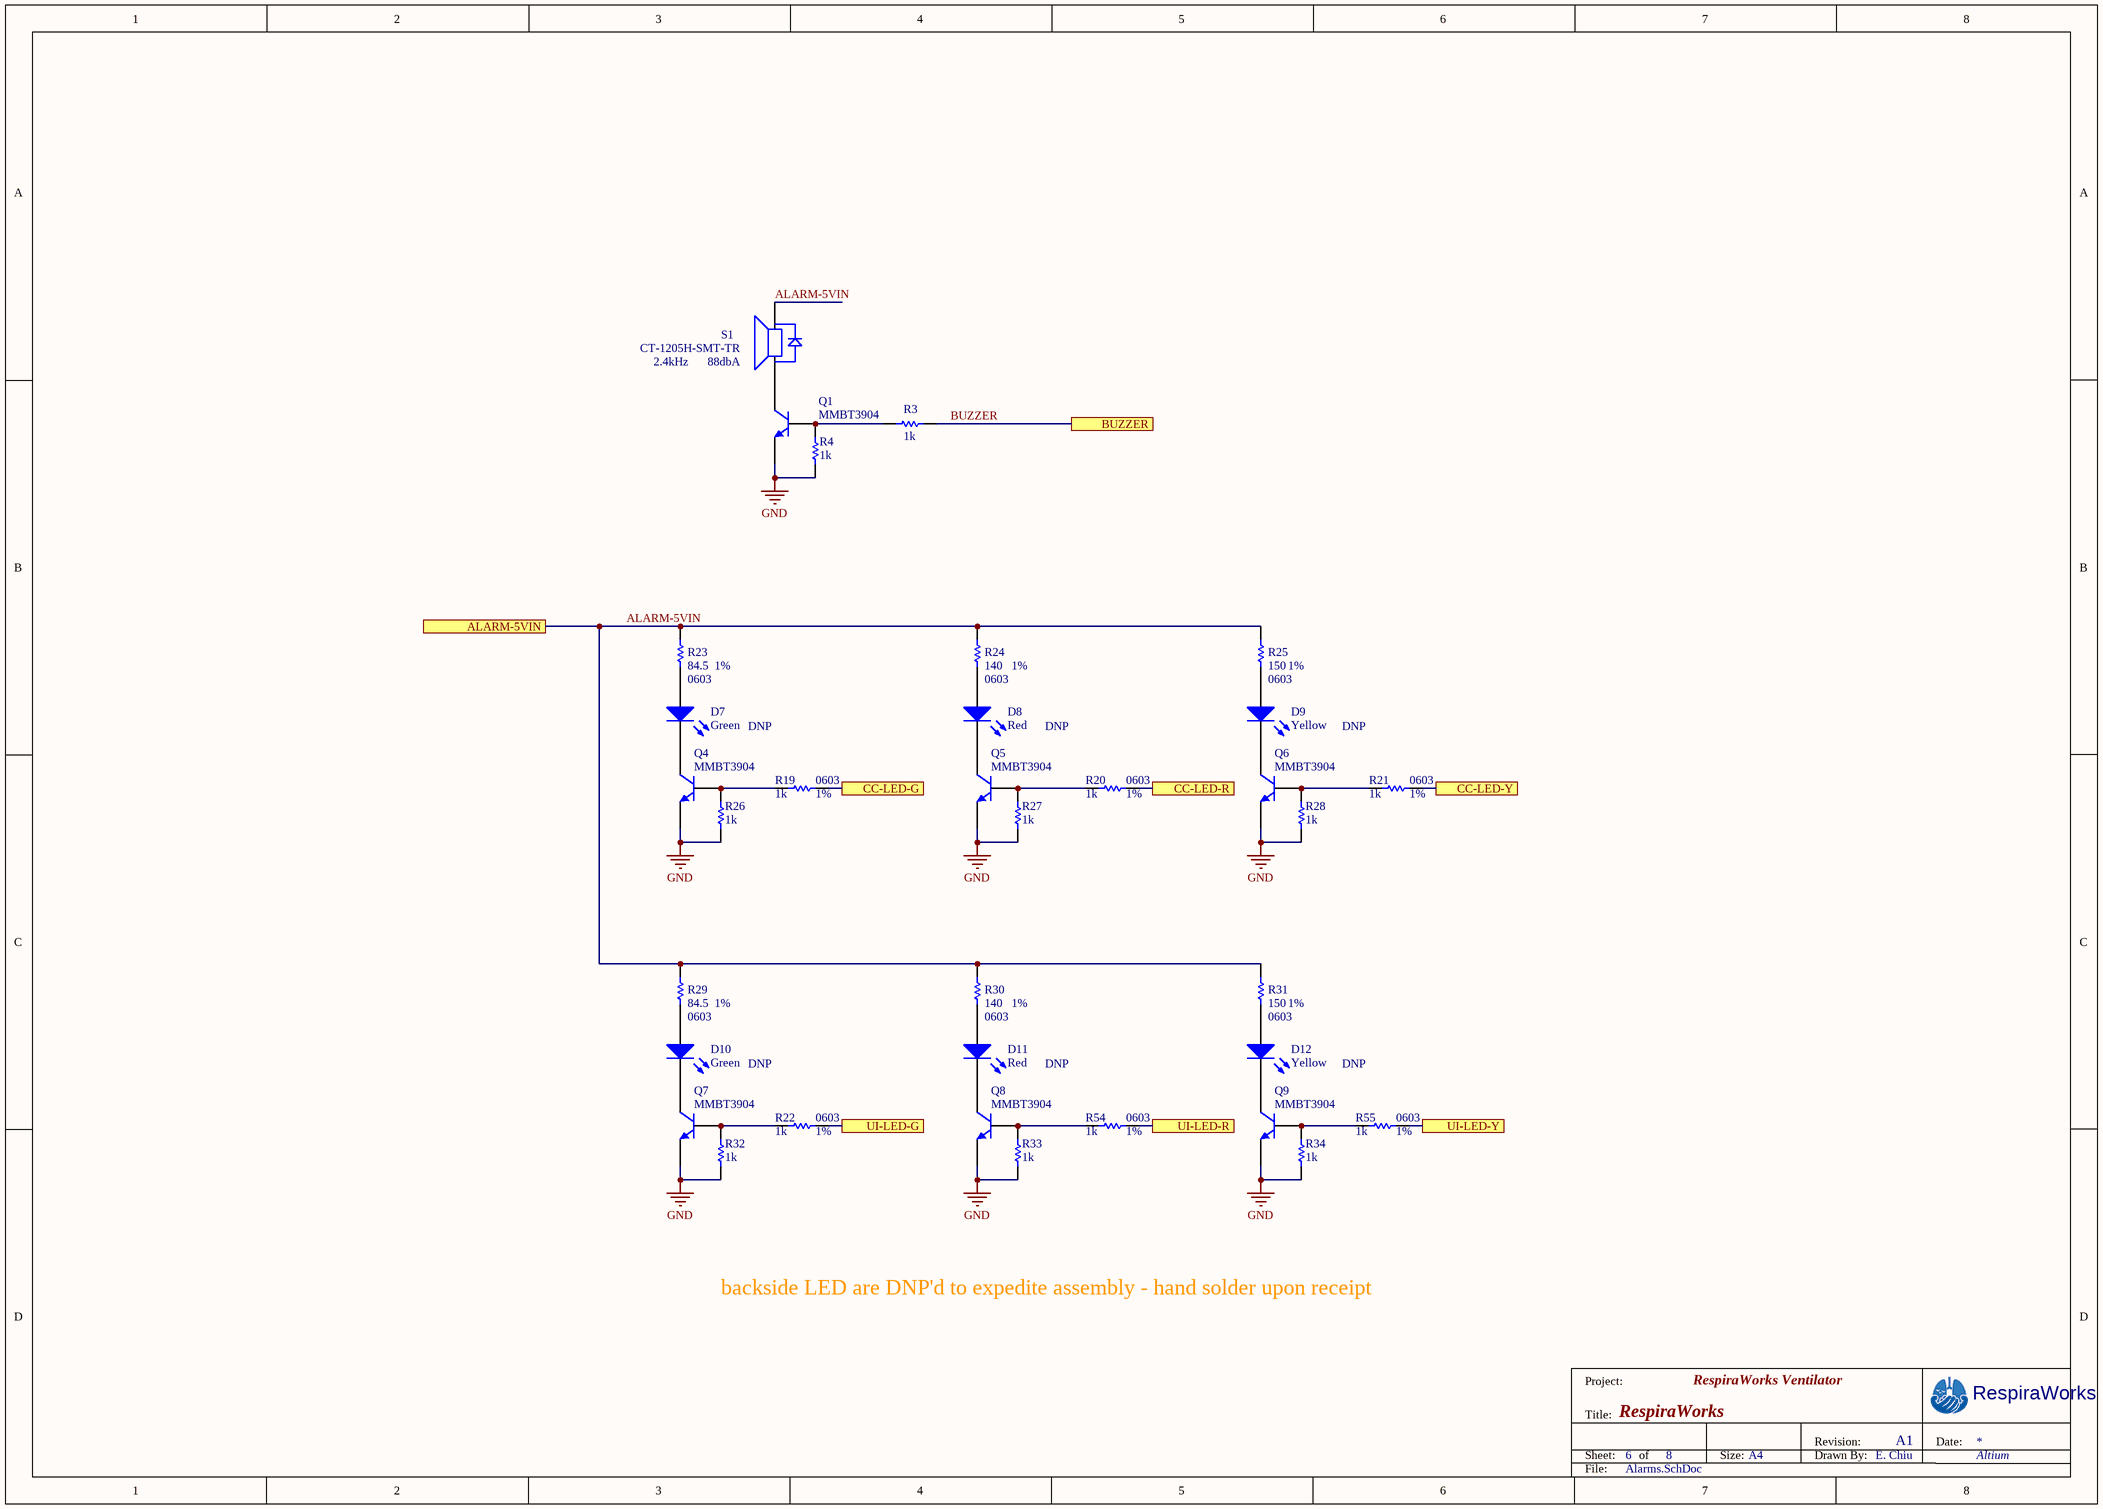
[diagram p6: Alarms.SchDoc]

### Parts
D7  value Green  Do Not Populate: DNP  [2-LED3528]  (hidden comment: LED 3528 GREEN 500MCD)
D8  value Red  Do Not Populate: DNP  [2-LED3528]  (hidden comment: LED 3528 RED 450MCD)
D9  value Yellow  Do Not Populate: DNP  [2-LED3528]  (hidden comment: LED 3528 YELLOW 450MCD)
D10  value Green  Do Not Populate: DNP  [2-LED3528]  (hidden comment: LED 3528 GREEN 500MCD)
D11  value Red  Do Not Populate: DNP  [2-LED3528]  (hidden comment: LED 3528 RED 450MCD)
D12  value Yellow  Do Not Populate: DNP  [2-LED3528]  (hidden comment: LED 3528 YELLOW 450MCD)
Q1  MMBT3904  [3-SOT23]
Q4  MMBT3904  [3-SOT23]
Q5  MMBT3904  [3-SOT23]
Q6  MMBT3904  [3-SOT23]
Q7  MMBT3904  [3-SOT23]
Q8  MMBT3904  [3-SOT23]
Q9  MMBT3904  [3-SOT23]
R3  value 1k  [RES0603]  (hidden comment: RES 0603)
R4  value 1k  [RES0603]  (hidden comment: RES 0603)
R19  value 1k  PCB Package: 0603  Tolerance: 1%  [RES0603]  (hidden comment: RES 0603)
R20  value 1k  PCB Package: 0603  Tolerance: 1%  [RES0603]  (hidden comment: RES 0603)
R21  value 1k  PCB Package: 0603  Tolerance: 1%  [RES0603]  (hidden comment: RES 0603)
R22  value 1k  PCB Package: 0603  Tolerance: 1%  [RES0603]  (hidden comment: RES 0603)
R23  value 84.5  PCB Package: 0603  Tolerance: 1%  [RES0603]  (hidden comment: RES 0603)
R24  value 140  PCB Package: 0603  Tolerance: 1%  [RES0603]  (hidden comment: RES 0603)
R25  value 150  PCB Package: 0603  Tolerance: 1%  [RES0603]  (hidden comment: RES 0603)
R26  value 1k  [RES0603]  (hidden comment: RES 0603)
R27  value 1k  [RES0603]  (hidden comment: RES 0603)
R28  value 1k  [RES0603]  (hidden comment: RES 0603)
R29  value 84.5  PCB Package: 0603  Tolerance: 1%  [RES0603]  (hidden comment: RES 0603)
R30  value 140  PCB Package: 0603  Tolerance: 1%  [RES0603]  (hidden comment: RES 0603)
R31  value 150  PCB Package: 0603  Tolerance: 1%  [RES0603]  (hidden comment: RES 0603)
R32  value 1k  [RES0603]  (hidden comment: RES 0603)
R33  value 1k  [RES0603]  (hidden comment: RES 0603)
R34  value 1k  [RES0603]  (hidden comment: RES 0603)
R54  value 1k  PCB Package: 0603  Tolerance: 1%  [RES0603]  (hidden comment: RES 0603)
R55  value 1k  PCB Package: 0603  Tolerance: 1%  [RES0603]  (hidden comment: RES 0603)
S1  value 88dbA  Frequency: 2.4kHz  [CT-1205H-SMT-TR]  (hidden comment: CT-1205H-SMT-TR)

### Ports
ALARM-5VIN, BUZZER, CC-LED-G, CC-LED-R, CC-LED-Y, UI-LED-G, UI-LED-R, UI-LED-Y

### Nets
ALARM-5VIN: R23.2 R24.2 R25.2 R29.2 R30.2 R31.2 S1.2 ; port ALARM-5VIN  [project net 5V]
GND: Q1.2(E) Q4.2(E) Q5.2(E) Q6.2(E) Q7.2(E) Q8.2(E) Q9.2(E) R4.1 R26.1 R27.1 R28.1 R32.1 R33.1 R34.1
BUZZER: R3.2 ; port BUZZER
CC-LED-G: R19.1 ; port CC-LED-G
CC-LED-R: R20.1 ; port CC-LED-R
CC-LED-Y: R21.1 ; port CC-LED-Y
UI-LED-G: R22.1 ; port UI-LED-G
UI-LED-R: R54.1 ; port UI-LED-R
UI-LED-Y: R55.1 ; port UI-LED-Y
NetD7_1: D7.1(K) Q4.3(C)
NetD7_2: D7.2(A) R23.1
NetD8_1: D8.1(K) Q5.3(C)
NetD8_2: D8.2(A) R24.1
NetD9_1: D9.1(K) Q6.3(C)
NetD9_2: D9.2(A) R25.1
NetD10_1: D10.1(K) Q7.3(C)
NetD10_2: D10.2(A) R29.1
NetD11_1: D11.1(K) Q8.3(C)
NetD11_2: D11.2(A) R30.1
NetD12_1: D12.1(K) Q9.3(C)
NetD12_2: D12.2(A) R31.1
NetQ1_1: Q1.1(B) R3.1 R4.2
NetQ1_3: Q1.3(C) S1.1
NetQ4_1: Q4.1(B) R19.2 R26.2
NetQ5_1: Q5.1(B) R20.2 R27.2
NetQ6_1: Q6.1(B) R21.2 R28.2
NetQ7_1: Q7.1(B) R22.2 R32.2
NetQ8_1: Q8.1(B) R33.2 R54.2
NetQ9_1: Q9.1(B) R34.2 R55.2

### Notes on the sheet
- backside LED are DNP'd to expedite assembly - hand solder upon receipt
- Project:
- RespiraWorks Ventilator
- Title:
- Sheet:
- of
- Size:
- A4
- Drawn By:
- Revision:
- Date:
- File:

### Library data of the parts
D7 D10 = LED 3528 GREEN 500MCD: Manufacturer P/N: AA3528ZGSK; Manufacturer: Kingbright; Vf: 3.3V; PCB Package: 2-LED3528; Color: Green; Intensity: 500mcd
D8 D11 = LED 3528 RED 450MCD: Manufacturer P/N: AA3528SESK/J3; Manufacturer: Kingbright; Vf: 2.2V; PCB Package: 2-LED3528; Color: Red; Intensity: 450mcd
D9 D12 = LED 3528 YELLOW 450MCD: Manufacturer P/N: AA3528SYCKT/J3; Manufacturer: Kingbright; Color: Green; Vf: 2V; PCB Package: 2-LED3528; Intensity: 450mcd
Q1 Q4-Q9 = MMBT3904: Transistor, BJT NPN, General Purpose 40V; Manufacturer: Fairchild; PCB Package: SOT23; Ic(max): 200mA; Vce(max): 40V; Manufacturer P/N: MMBT3904
R3 R4 R26-R28 R32-R34 = RES 0603: Manufacturer P/N: RC0603FR-071KL; Manufacturer: Yageo; PCB Package: 0603; Tolerance: *; Do Not Populate: *
R19-R22 R54 R55 = RES 0603: as R50 on sheet Switches; Do Not Populate: *
R23 R29 = RES 0603: Manufacturer P/N: RC0603FR-0784R5L; Manufacturer: Yageo; Do Not Populate: *
R24 R30 = RES 0603: Manufacturer P/N: RC0603FR-07140RL; Manufacturer: Yageo; Do Not Populate: *
R25 R31 = RES 0603: Manufacturer P/N: RC0603FR-07150RL; Manufacturer: Yageo; Do Not Populate: *
S1 = CT-1205H-SMT-TR: Buzzers Transducer, Externally Driven Magnetic 5V 60mA 2.4kHz 88dB @ 5V, 10cm Surface Mount Solder Pads; Manufacturer: CUI; Manufacturer P/N: CT-1205H-SMT-TR; PCB Package: CT-1205H-SMT-TR; Tolerance: *; Do Not Populate: *

## Sheet Power.SchDoc: RespiraWorks
size A3; CompanyName: RespiraWorks; DrawnBy: E. Chiu; Organization: Altium; DocumentNumber: 2; Revision: A1; SheetNumber: 2; SheetTotal: 8; PageSetup: Record=PageOptions|CenterHorizontal=True|CenterVertical=True|PrintScale=0.67|XCorrection=1.00|YCorrection=1.00|PrintKind=0|BorderSize=5000000|LeftOffset=0|BottomOffset=0|Orientation=2|PaperLength=1000|PaperWidth=1000|Scale=100|PaperSource=276|PrintQuality=-3|MediaType=1|DitherType=10|PrintScaleMode=1|PaperKind=11"x17" 279.4x431.8mm|PaperIndex=3; ProjectName: FALCON 3S
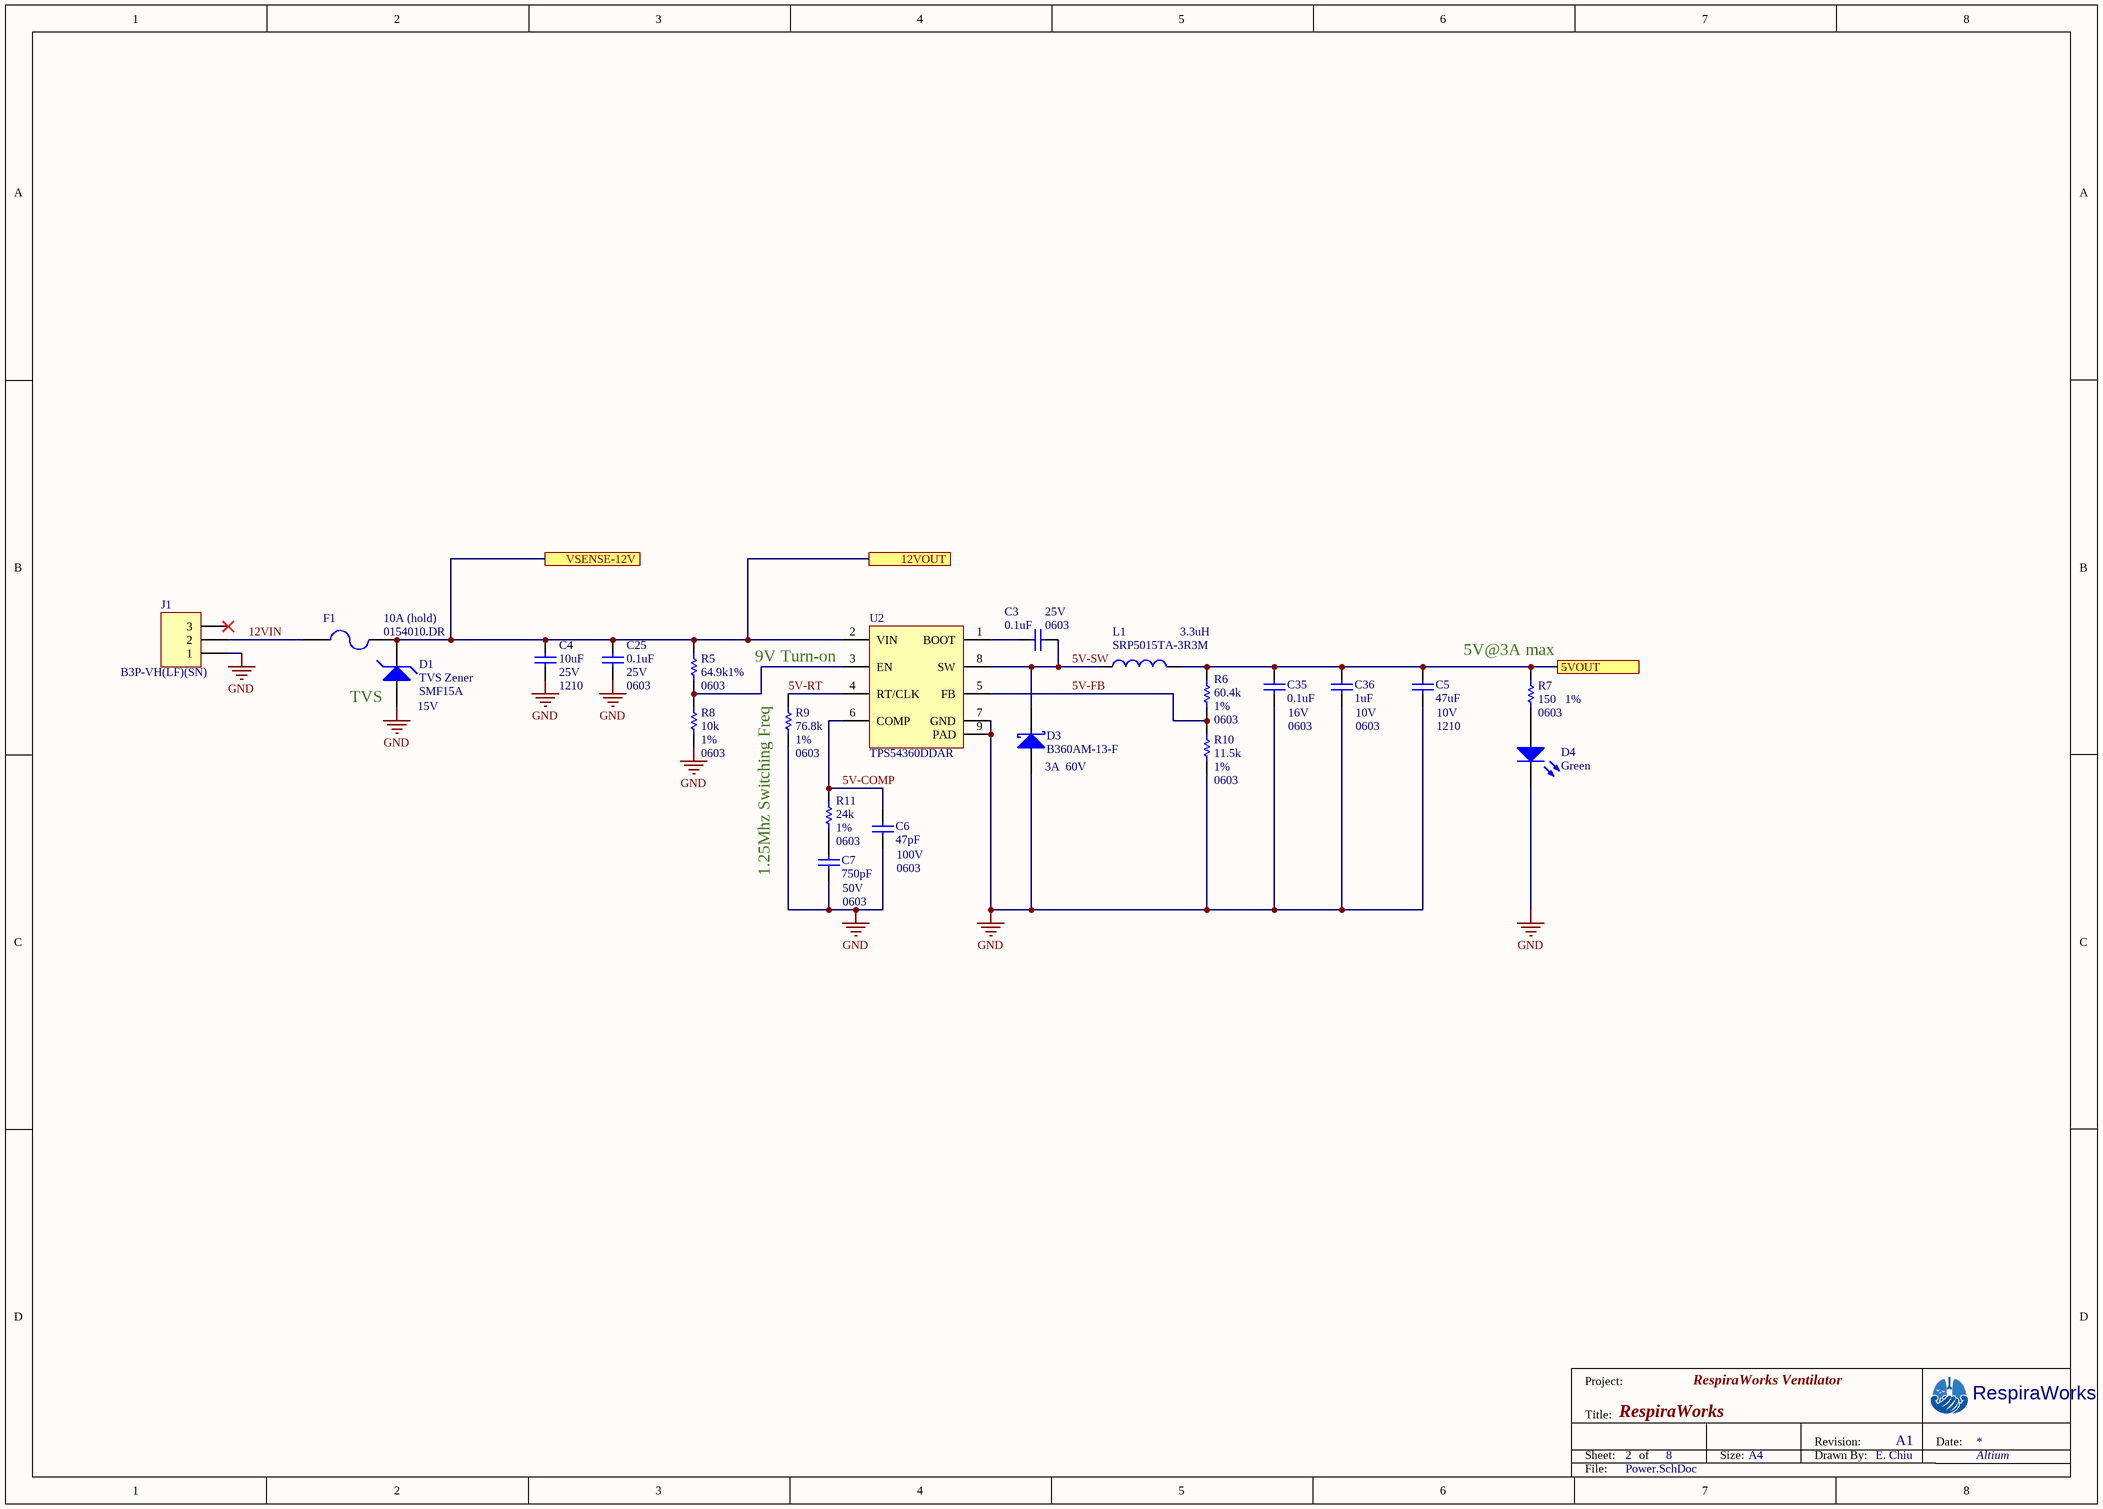
[diagram p7: Power.SchDoc]

### Parts
C3  value 0.1uF  Voltage: 25V  PCB Package: 0603  [CAP0603]  (hidden comment: CAP 0603)
C4  value 10uF  Voltage: 25V  PCB Package: 1210  [CAP1210]  (hidden comment: CAP 1210)
C5  value 47uF  Voltage: 10V  PCB Package: 1210  [CAP1210]  (hidden comment: CAP 1210)
C6  value 47pF  Voltage: 100V  PCB Package: 0603  [CAP0603]  (hidden comment: CAP 0603)
C7  value 750pF  Voltage: 50V  PCB Package: 0603  [CAP0603]  (hidden comment: CAP 0603)
C25  value 0.1uF  Voltage: 25V  PCB Package: 0603  [CAP0603]  (hidden comment: CAP 0603)
C35  value 0.1uF  Voltage: 16V  PCB Package: 0603  [CAP0603]  (hidden comment: CAP 0603)
C36  value 1uF  Voltage: 10V  PCB Package: 0603  [CAP0603]  (hidden comment: CAP 0603)
D1  TVS Zener  Vr: 15V  [SOD-123F]
D3  Reverse Voltage: 60V  I(max): 3A  [DO-214AC]  (hidden comment: *)
D4  value Green  [LED0603]  (hidden comment: LED 0603)
F1  value 10A (hold)  Manufacturer P/N: 0154010.DR  [0154]  (hidden comment: Fast Blow)
J1  B3P-VH(LF)(SN)  [B3P-VH(LF)(SN)]
L1  value 3.3uH  [SRP5015]  (hidden comment: SRP5015TA-3R3M)
R5  value 64.9k  PCB Package: 0603  Tolerance: 1%  [RES0603]  (hidden comment: RES 0603)
R6  value 60.4k  PCB Package: 0603  Tolerance: 1%  [RES0603]  (hidden comment: RES 0603)
R7  value 150  PCB Package: 0603  Tolerance: 1%  [RES0603]  (hidden comment: RES 0603)
R8  value 10k  PCB Package: 0603  Tolerance: 1%  [RES0603]  (hidden comment: RES 0603)
R9  value 76.8k  PCB Package: 0603  Tolerance: 1%  [RES0603]  (hidden comment: RES 0603)
R10  value 11.5k  PCB Package: 0603  Tolerance: 1%  [RES0603]  (hidden comment: RES 0603)
R11  value 24k  PCB Package: 0603  Tolerance: 1%  [RES0603]  (hidden comment: RES 0603)
U2  Manufacturer P/N: TPS54360DDAR  [DDA]  (hidden comment: TPS54360)

### Ports
5VOUT, 12VOUT, VSENSE-12V

### Nets
5V: C5.2 C35.1 C36.1 L1.2 R6.2 R7.2 ; port 5VOUT
12V: C4.2 C25.1 D1.K F1.2 R5.2 U2.2(VIN) ; port VSENSE-12V, port 12VOUT
GND: C4.1 C5.1 C6.1 C7.1 C25.2 C35.2 C36.2 D1.A D3.A D4.K J1.1 R8.1 R9.1 R10.1 U2.7(GND) U2.9(PAD)
5V-COMP: C6.2 R11.2 U2.6(COMP)
5V-FB: R6.1 R10.2 U2.5(FB)
5V-RT: R9.2 U2.4(RT/CLK)
5V-SW: C3.2 D3.K L1.1 U2.8(SW)
12VIN: F1.1 J1.2
NetC3_1: C3.1 U2.1(BOOT)
NetC7_2: C7.2 R11.1
NetD4_A: D4.A R7.1
NetR5_1: R5.1 R8.2 U2.3(EN)

Not connected (* = marked no-connect by the designer): J1 3*

### Notes on the sheet
- (near D1) TVS
- 9V Turn-on
- (near R7) 5V@3A max
- (near R9) 1.25Mhz Switching Freq
- Project:
- RespiraWorks Ventilator
- Title:
- Sheet:
- of
- Size:
- A4
- Drawn By:
- Revision:
- Date:
- File:

### Library data of the parts
C3 C25 = CAP 0603: Manufacturer P/N: CC0603KRX7R8BB104; Manufacturer: Yageo; Type: X7R; Do Not Populate: *
C4 = CAP 1210: Manufacturer P/N: GRM32DR71E106KA12L; Manufacturer: Murata; Type: X7R; Do Not Populate: *
C5 = CAP 1210: Manufacturer P/N: GRM32ER71A476KE15L; Manufacturer: Murata; Type: X7R; Do Not Populate: *
C6 = CAP 0603: Manufacturer P/N: C0603C470J1GACTU; Manufacturer: Kemet; Type: NP0; Do Not Populate: *
C7 = CAP 0603: Manufacturer P/N: CL10B751KB8NNNC; Manufacturer: Samsung; Type: X7R; Do Not Populate: *
C35 = CAP 0603: as C24 on sheet Cycle-Controller; Do Not Populate: *
C36 = CAP 0603: as C23 on sheet Cycle-Controller; Do Not Populate: *
D1 = SMF15A: TVS Diode, Zener, 15V Standoff, 24V Clamp, 8.2A; Manufacturer: Littelfuse; Vbr(min): 16.7V; Do Not Populate: *; PCB Package: SOD-123F; I(pulse): 8.2A; Manufacturer P/N: SMF15A
D3 = B360AM-13-F: DIODE SCHOTTKY 60V 3A SMA; Manufacturer: Diodes Inc.; PCB Package: DO-214AC (SMA); Do Not Populate: *; Type: Schottky; Manufacturer P/N: B360AM-13-F
D4 = LED 0603: Manufacturer P/N: LTST-C191KGKT; Manufacturer: Lite-On; PCB Package: 0603; Vf: 2V; Intensity: 35mcd@20mA; Color: Green; Do Not Populate: *
F1 = 0154010: Fast Blow Nano Fuse in Holder, 10A, 125V; Manufacturer: Littelfuse; V(max): 125V AC/DC; I(hold): 10A; I(trip): 10A
J1 = B3P-VH(LF)(SN): JST-VH HEADER VERT 3POS 3.96MM; Manufacturer: JST; Do Not Populate: *; Manufacturer P/N: B3P-VH(LF)(SN)
L1 = SRP5015TA-3R3M: Inductor, 501 Series, Shielded 2.2uH, 4A; Manufacturer: Bourns; I(rms): 3.2A; I(sat): 4.5A; DCR: 78mohm; Do Not Populate: *; PCB Package: SRP5015; Manufacturer P/N: SRP5015TA-3R3M
R5 = RES 0603: Manufacturer P/N: RC0603FR-0764K9L; Manufacturer: Yageo; Do Not Populate: *
R6 = RES 0603: Manufacturer P/N: RC0603FR-0760K4L; Manufacturer: Yageo; Do Not Populate: *
R7 = RES 0603: Manufacturer P/N: ERJ-3EKF1500V; Manufacturer: Panasonic; Do Not Populate: *
R8 = RES 0603: as R59 on sheet TOP; Do Not Populate: *
R9 = RES 0603: Manufacturer P/N: RC0603FR-0776K8L; Manufacturer: Yageo; Do Not Populate: *
R10 = RES 0603: Manufacturer P/N: RC0603FR-0711K5L; Manufacturer: Yageo; Do Not Populate: *
R11 = RES 0603: Manufacturer P/N: ERJ-3EKF2402V; Manufacturer: Panasonic; Do Not Populate: *
U2 = TPS54360: DC-DC Buck, 60V Input, 3.5A Int Sw, Ultra Low Quiescent Power; Manufacturer: Texas Instruments; PCB Package: SOIC8; Do Not Populate: *